# EAGLE design bldc_controller (EAGLE 6.5.0)
AUTHOR: Douglas Hutchings; REVISION: A; YEAR: 2014

## Sheet 1 of 5
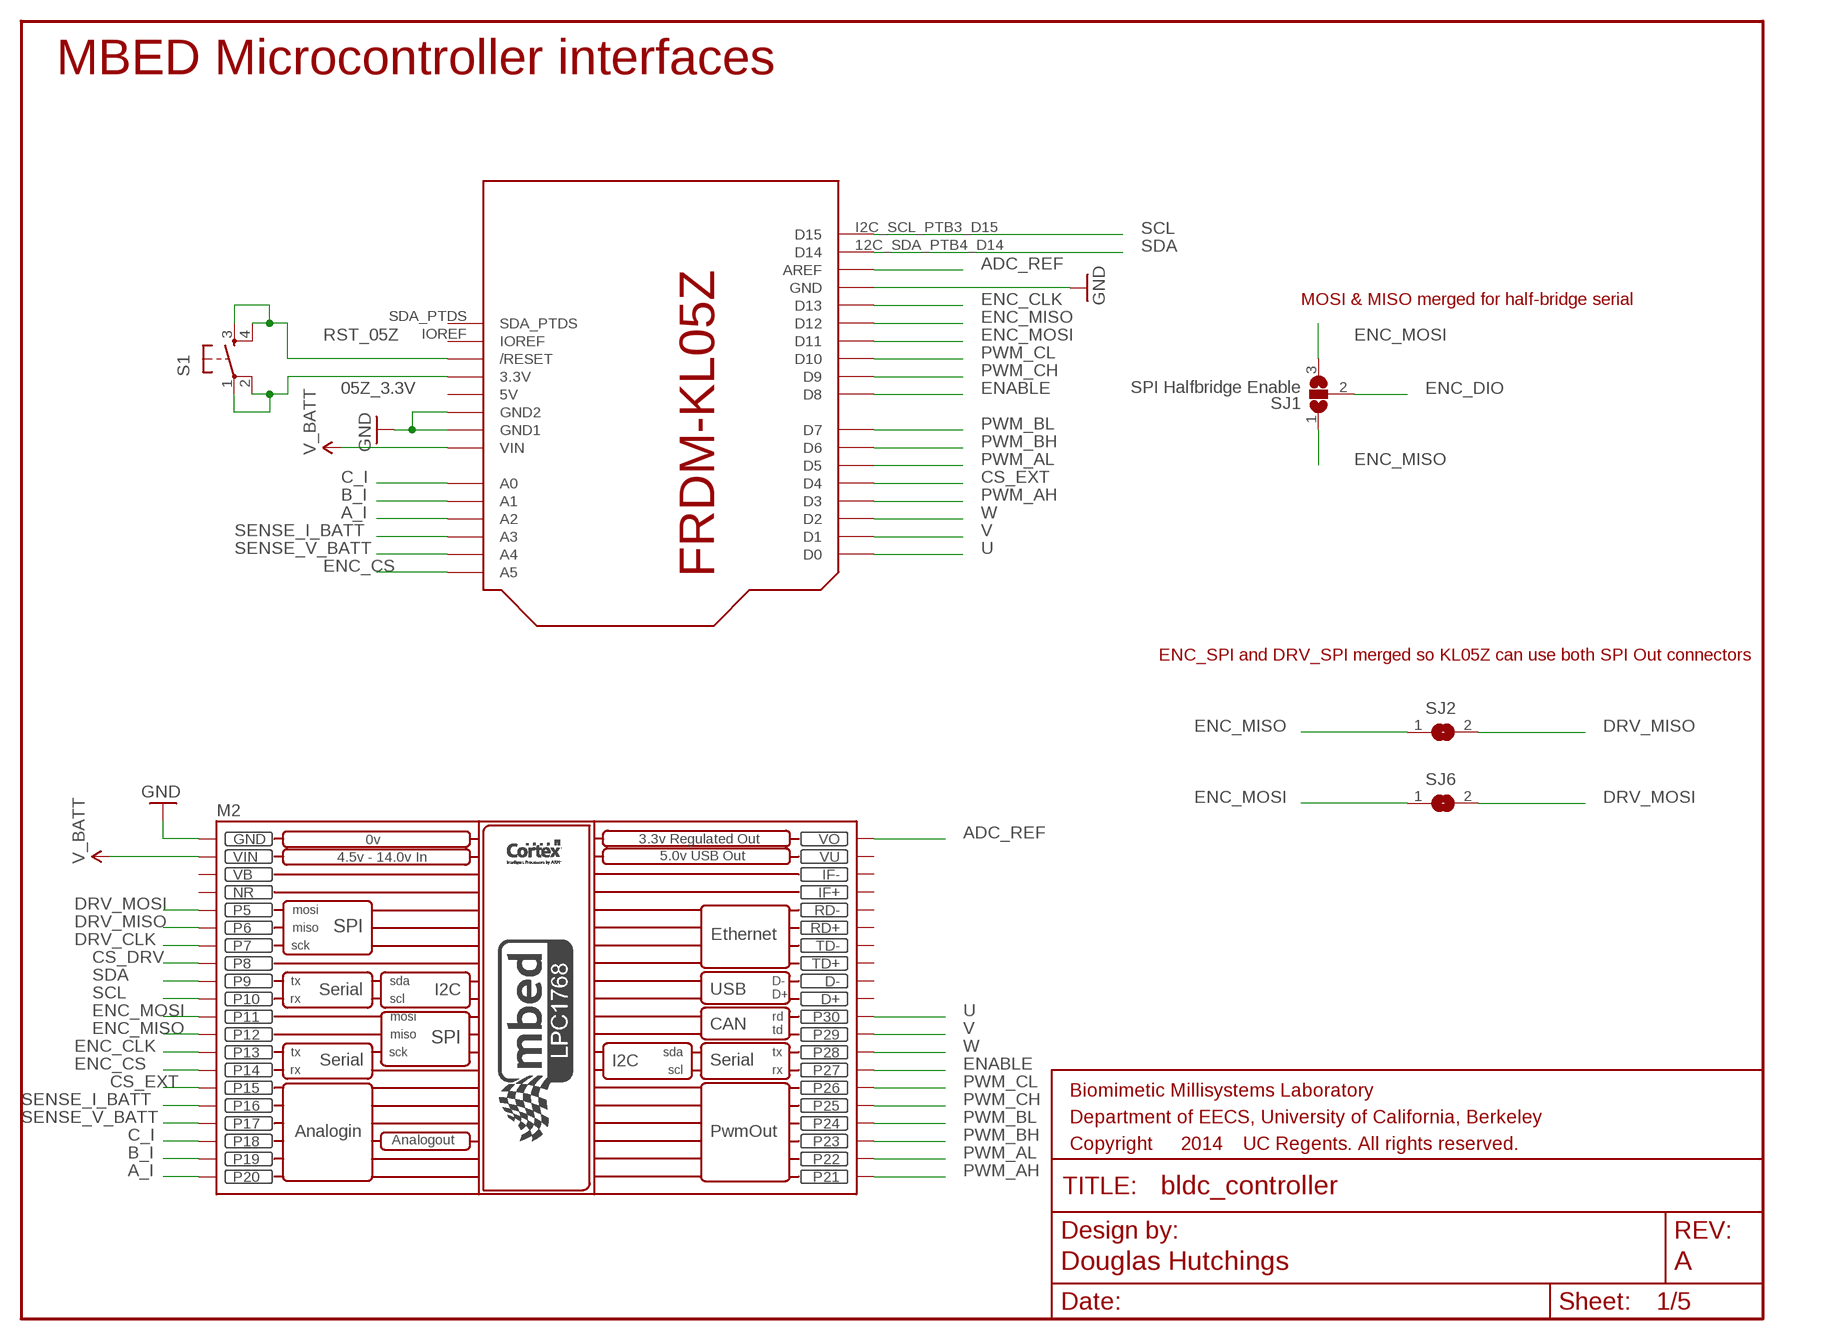
[diagram p0: schematic, sheet 1]

### Parts
M1  FRDM-KL05Z  [FREESCALEKL05Z]
M2  MBED_NXP_LPC1768  [MBED-KIT]
S1  TAC_SWITCHPTH  [TACTILE-PTH]
SJ1  SPI Halfbridge Enable  SJ2W  [SJ_2]
SJ2  SJ  [SJ]
SJ6  SJ  [SJ]

### Nets
05Z_3.3V: M1.3.3V S1.1 S1.2
A_I: M1.A2_PTA8(A2) M2.P$20(P20) ; also sheet 2
ADC_REF: M1.AVDD(AREF) M2.VOUT(VO) ; also sheet 2
B_I: M1.A1_PTB9(A1) M2.P$19(P19) ; also sheet 2
C_I: M1.A0_PTB8(A0) M2.P$18(P18) ; also sheet 2
CS_DRV: M2.P$8(P8) ; also sheet 2
CS_EXT: M1.PTA10_D4(D4) M2.P$15(P15) ; also sheet 4
DRV_CLK: M2.P$7(P7) ; also sheet 2
DRV_MISO: M2.P$6(P6) SJ2.2 ; also sheet 2,4
DRV_MOSI: M2.P$5(P5) SJ6.2 ; also sheet 2,4
ENABLE: M1.PTB10_D8(D8) M2.P$27(P27) ; also sheet 2
ENC_CLK: M1.SCK_PTB0_D13(D13) M2.P$13(P13) ; also sheet 5
ENC_CS: M1.A5_PTB13(A5) M2.P$14(P14) ; also sheet 4,5
ENC_DIO: SJ1.2 ; also sheet 5
ENC_MISO: M1.MISO_PTA6_D12(D12) M2.P$12(P12) SJ1.1 SJ2.1 ; also sheet 4
ENC_MOSI: M1.MOSI_PTA_D11(D11) M2.P$11(P11) SJ1.3 SJ6.1 ; also sheet 4
GND: M1.GND M1.GND1 M1.GND2 M2.GND ; also sheet 2,3,4,5
PWM_AH: M1.PTB5_D3(D3) M2.P$21(P21) ; also sheet 2
PWM_AL: M1.PTA12_D5(D5) M2.P$22(P22) ; also sheet 2
PWM_BH: M1.PTB6_D6(D6) M2.P$23(P23) ; also sheet 2
PWM_BL: M1.PTB7_D7(D7) M2.P$24(P24) ; also sheet 2
PWM_CH: M1.PTB11_D9(D9) M2.P$25(P25) ; also sheet 2
PWM_CL: M1.PTA_D10(D10) M2.P$26(P26) ; also sheet 2
RST_05Z: M1.RESET(/RESET) S1.3 S1.4
SCL: M1.I2C_SCL_PTB3_D15(D15) M2.P$10(P10) ; also sheet 4
SDA: M1.12C_SDA_PTB4_D14(D14) M2.P$9(P9) ; also sheet 4
SENSE_I_BATT: M1.A3_PTA0(A3) M2.P$16(P16) ; also sheet 3
SENSE_V_BATT: M1.A4_PTA9(A4) M2.P$17(P17) ; also sheet 3
U: M1.TX_PTB2_D0(D0) M2.P$30(P30) ; also sheet 4,5
V: M1.RX_PTB1_D1(D1) M2.P$29(P29) ; also sheet 4,5
V_BATT: M1.VIN M2.VIN ; also sheet 2,3,4,5
W: M1.PTA11_D2(D2) M2.P$28(P28) ; also sheet 4,5
Unconnected: M1.5V M1.IOREF M1.SDA_PTDS M2.D+ M2.D- M2.IF+ M2.IF- M2.RD+ M2.RD- M2.TD+ M2.TD- M2.VU

### Notes on the sheet
- MBED Microcontroller interfaces
- MOSI & MISO merged for half-bridge serial
- ENC_SPI and DRV_SPI merged so KL05Z can use both SPI Out connectors

## Sheet 2 of 5
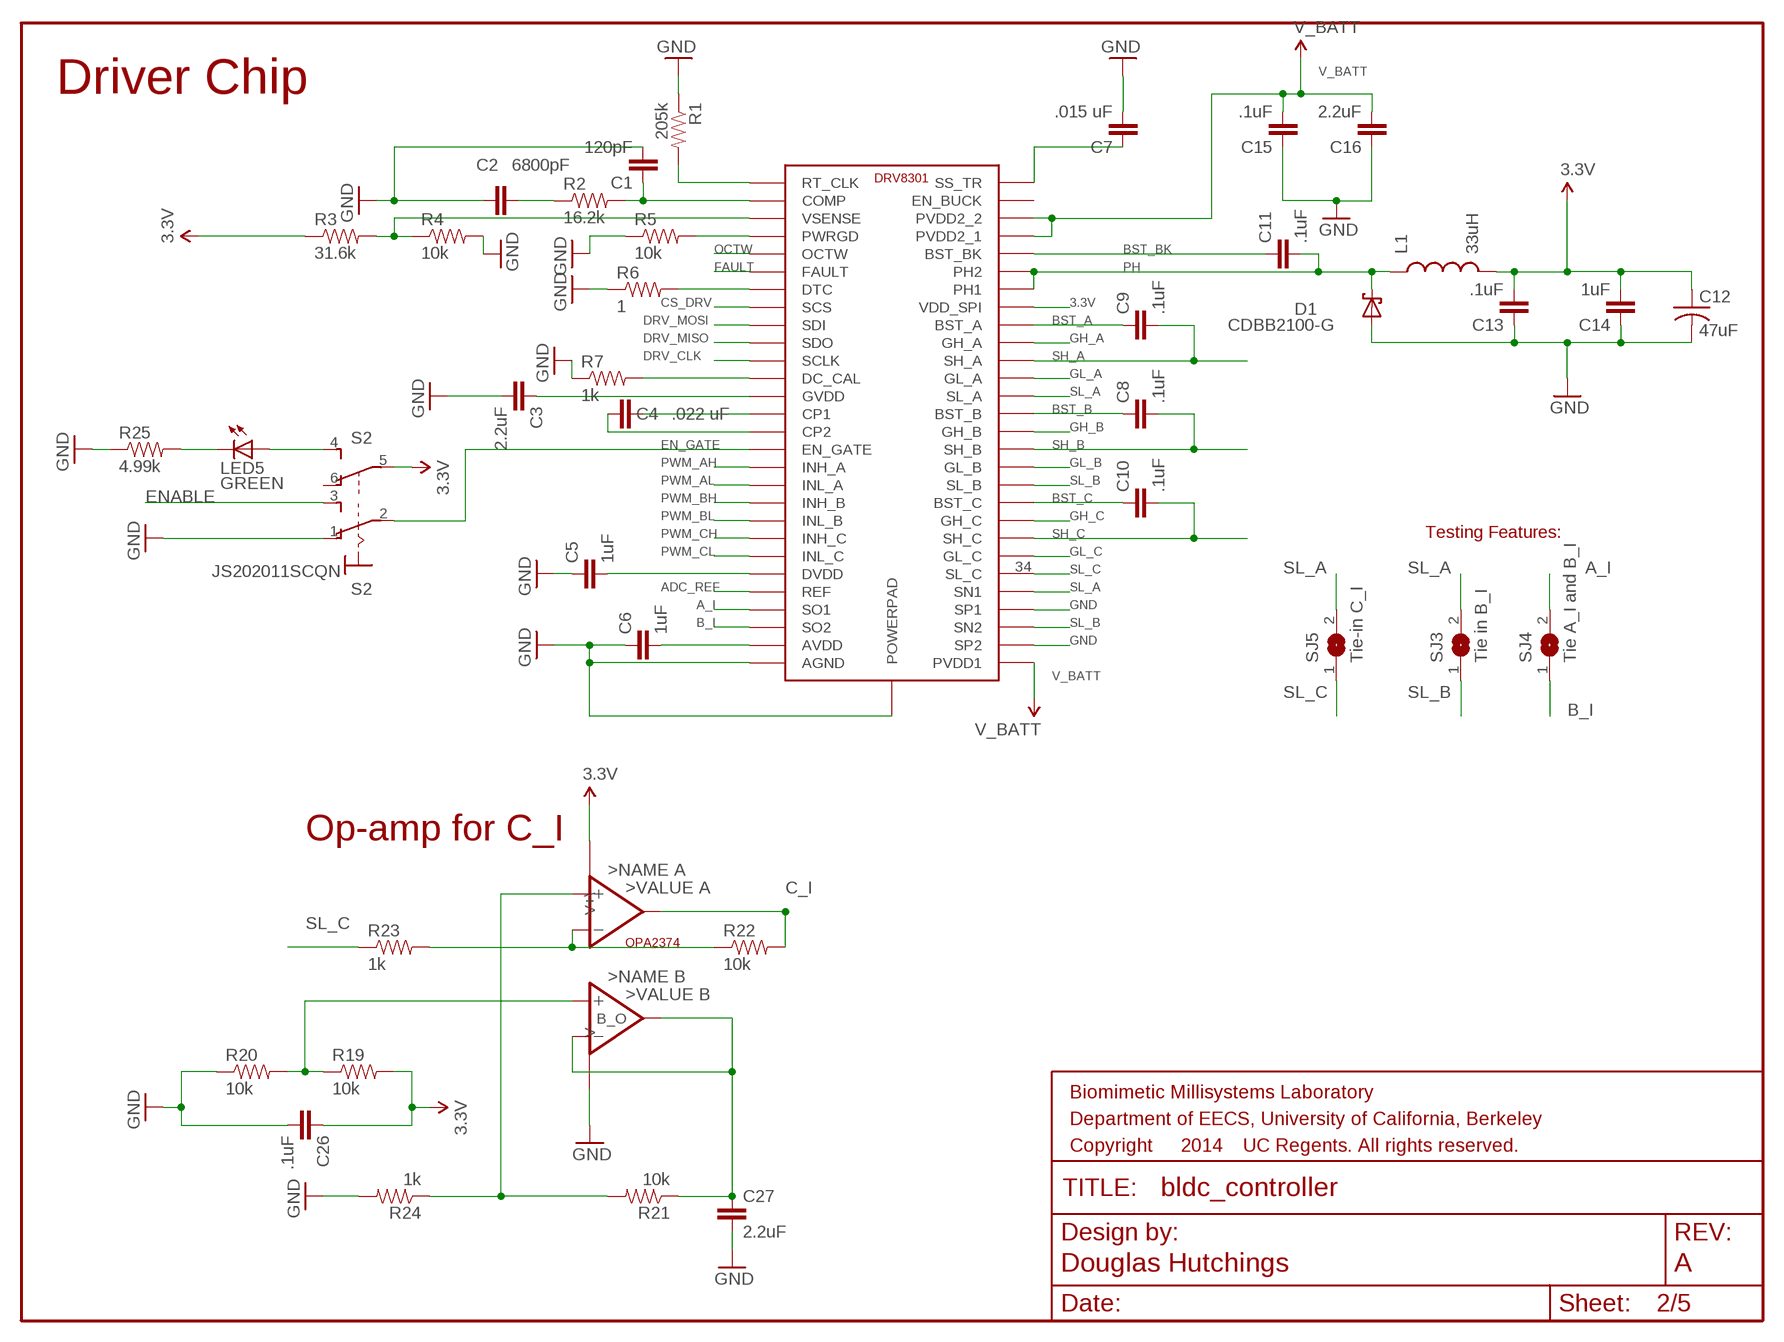
[diagram p1: schematic, sheet 2]

### Parts
C1  120pF  CAP0402-CAP  [0402-CAP]
C2  6800pF  CAP0402-CAP  [0402-CAP]
C3  2.2uF  CAP0402-CAP  [0402-CAP]
C4  .022 uF  CAP0402-CAP  [0402-CAP]
C5  1uF  CAP0402-CAP  [0402-CAP]
C6  1uF  CAP0402-CAP  [0402-CAP]
C7  .015 uF  CAP0402-CAP  [0402-CAP]
C8  .1uF  CAP0402-CAP  [0402-CAP]
C9  .1uF  CAP0402-CAP  [0402-CAP]
C10  .1uF  CAP0402-CAP  [0402-CAP]
C11  .1uF  CAP0402-CAP  [0402-CAP]
C12  47uF  C-USC0603  [C0603]
C13  .1uF  CAP0402-CAP  [0402-CAP]
C14  1uF  CAP0402-CAP  [0402-CAP]
C15  .1uF  CAP0402-CAP  [0402-CAP]
C16  2.2uF  CAP0402-CAP  [0402-CAP]
C26  .1uF  CAP0402-CAP  [0402-CAP]
C27  2.2uF  CAP0402-CAP  [0402-CAP]
D1  CDBB2100-G  SCHOTTKY-DIODESMD  [SMB]
IC1  DRV8301  [DRV8301]
IC2  OPA2374  [SOT-23]
L1  33uH  INDUCTOR0805  [0805]
LED5  GREEN  LED0603  [LED-0603]
R1  205k  RESISTOR0402-RES  [0402-RES]
R2  16.2k  RESISTOR0402-RES  [0402-RES]
R3  31.6k  RESISTOR0402-RES  [0402-RES]
R4  10k  RESISTOR0402-RES  [0402-RES]
R5  10k  RESISTOR0402-RES  [0402-RES]
R6  1  RESISTOR0402-RES  [0402-RES]
R7  1k  RESISTOR0402-RES  [0402-RES]
R19  10k  RESISTOR0402-RES  [0402-RES]
R20  10k  RESISTOR0402-RES  [0402-RES]
R21  10k  RESISTOR0402-RES  [0402-RES]
R22  10k  RESISTOR0402-RES  [0402-RES]
R23  1k  RESISTOR0402-RES  [0402-RES]
R24  1k  RESISTOR0402-RES  [0402-RES]
R25  4.99k  RESISTOR0603-RES  [0603-RES]
S2  JS202011SCQN  [JS202011SCQN]
SJ3  Tie in B_I  SJ  [SJ]
SJ4  Tie A_I and B_I  SJ  [SJ]
SJ5  Tie-in C_I  SJ  [SJ]

### Nets
3.3V: C12.1 C13.2 C14.2 C26.1 IC1.49(VDD_SPI) IC2.5(V+\) L1.2 R3.1 R19.2 S2.5(P) ; also sheet 4,5
3.3V1: LED5.A S2.4(S)
A_I: IC1.25(SO1) SJ4.2 ; also sheet 1
ADC_REF: IC1.24(REF) ; also sheet 1
AVDD: C6.2 IC1.27(AVDD)
B_I: IC1.26(SO2) SJ4.1 ; also sheet 1
BST_A: C9.1 IC1.48(BST_A)
BST_B: C8.1 IC1.43(BST_B)
BST_BK: C11.1 IC1.52(BST_BK)
BST_C: C10.1 IC1.38(BST_C)
C_I: IC2.1(A_O) R22.2 ; also sheet 1
CP1: C4.2 IC1.14(CP1)
CP2: C4.1 IC1.15(CP2)
CS_DRV: IC1.8(SCS) ; also sheet 1
DC_CAL: IC1.12(DC_CAL) R7.2
DRV_CLK: IC1.11(SCLK) ; also sheet 1
DRV_MISO: IC1.10(SDO) ; also sheet 1,4
DRV_MOSI: IC1.9(SDI) ; also sheet 1,4
DTC: IC1.7(DTC) R6.2
DVDD: C5.2 IC1.23(DVDD)
EN_GATE: IC1.16(EN_GATE) S2.2(P)
ENABLE: S2.3(S) ; also sheet 1
FAULT: IC1.6(FAULT) ; also sheet 4
GH_A: IC1.47(GH_A) ; also sheet 3
GH_B: IC1.42(GH_B) ; also sheet 3
GH_C: IC1.37(GH_C) ; also sheet 3
GL_A: IC1.45(GL_A) ; also sheet 3
GL_B: IC1.40(GL_B) ; also sheet 3
GL_C: IC1.35(GL_C) ; also sheet 3
GND: C1.2 C2.2 C3.2 C5.1 C6.1 C7.2 C12.2 C13.1 C14.1 C15.1 C16.1 C26.2 C27.2 D1.A IC1.28(AGND) IC1.30(SP2) IC1.32(SP1) IC1.EXP@1(POWERPAD) IC1.EXP@2(POWERPAD) IC2.4(V-) R1.1 R4.2 R5.1 R6.1 R7.1 R20.1 R24.2 R25.1 S2.1(O) ; also sheet 1,3,4,5
GVDD: C3.1 IC1.13(GVDD)
N$1: C1.1 IC1.2(COMP) R2.2
N$2: C2.1 R2.1
N$12: IC2.8(B+) R19.1 R20.2
N$14: C27.1 IC2.6(B_O) IC2.7(B-) R21.1
N$15: IC2.3(A+) R21.2 R24.1
N$16: IC2.2(A-) R22.1 R23.2
N$19: LED5.C R25.2
OCTW: IC1.5(OCTW) ; also sheet 4
PH: C11.2 D1.C IC1.50(PH1) IC1.51(PH2) L1.1
PWM_AH: IC1.17(INH_A) ; also sheet 1
PWM_AL: IC1.18(INL_A) ; also sheet 1
PWM_BH: IC1.19(INH_B) ; also sheet 1
PWM_BL: IC1.20(INL_B) ; also sheet 1
PWM_CH: IC1.21(INH_C) ; also sheet 1
PWM_CL: IC1.22(INL_C) ; also sheet 1
PWRGD: IC1.4(PWRGD) R5.2
RT_CLK: IC1.1(RT_CLK) R1.2
SH_A: C9.2 IC1.46(SH_A) ; also sheet 3
SH_B: C8.2 IC1.41(SH_B) ; also sheet 3
SH_C: C10.2 IC1.36(SH_C) ; also sheet 3
SL_A: IC1.33(SN1) IC1.44(SL_A) SJ3.2 SJ5.2 ; also sheet 3
SL_B: IC1.31(SN2) IC1.39(SL_B) SJ3.1 ; also sheet 3
SL_C: IC1.34(SL_C) R23.1 SJ5.1 ; also sheet 3
SS_TR: C7.1 IC1.56(SS_TR)
V_BATT: C15.2 C16.2 IC1.29(PVDD1) IC1.53(PVDD2_1) IC1.54(PVDD2_2) ; also sheet 1,3,4,5
VSENSE: IC1.3(VSENSE) R3.2 R4.1
Unconnected: IC1.55(EN_BUCK) S2.6(O)

### Notes on the sheet
- Driver Chip
- Testing Features:
- Op-amp for C_I

## Sheet 3 of 5
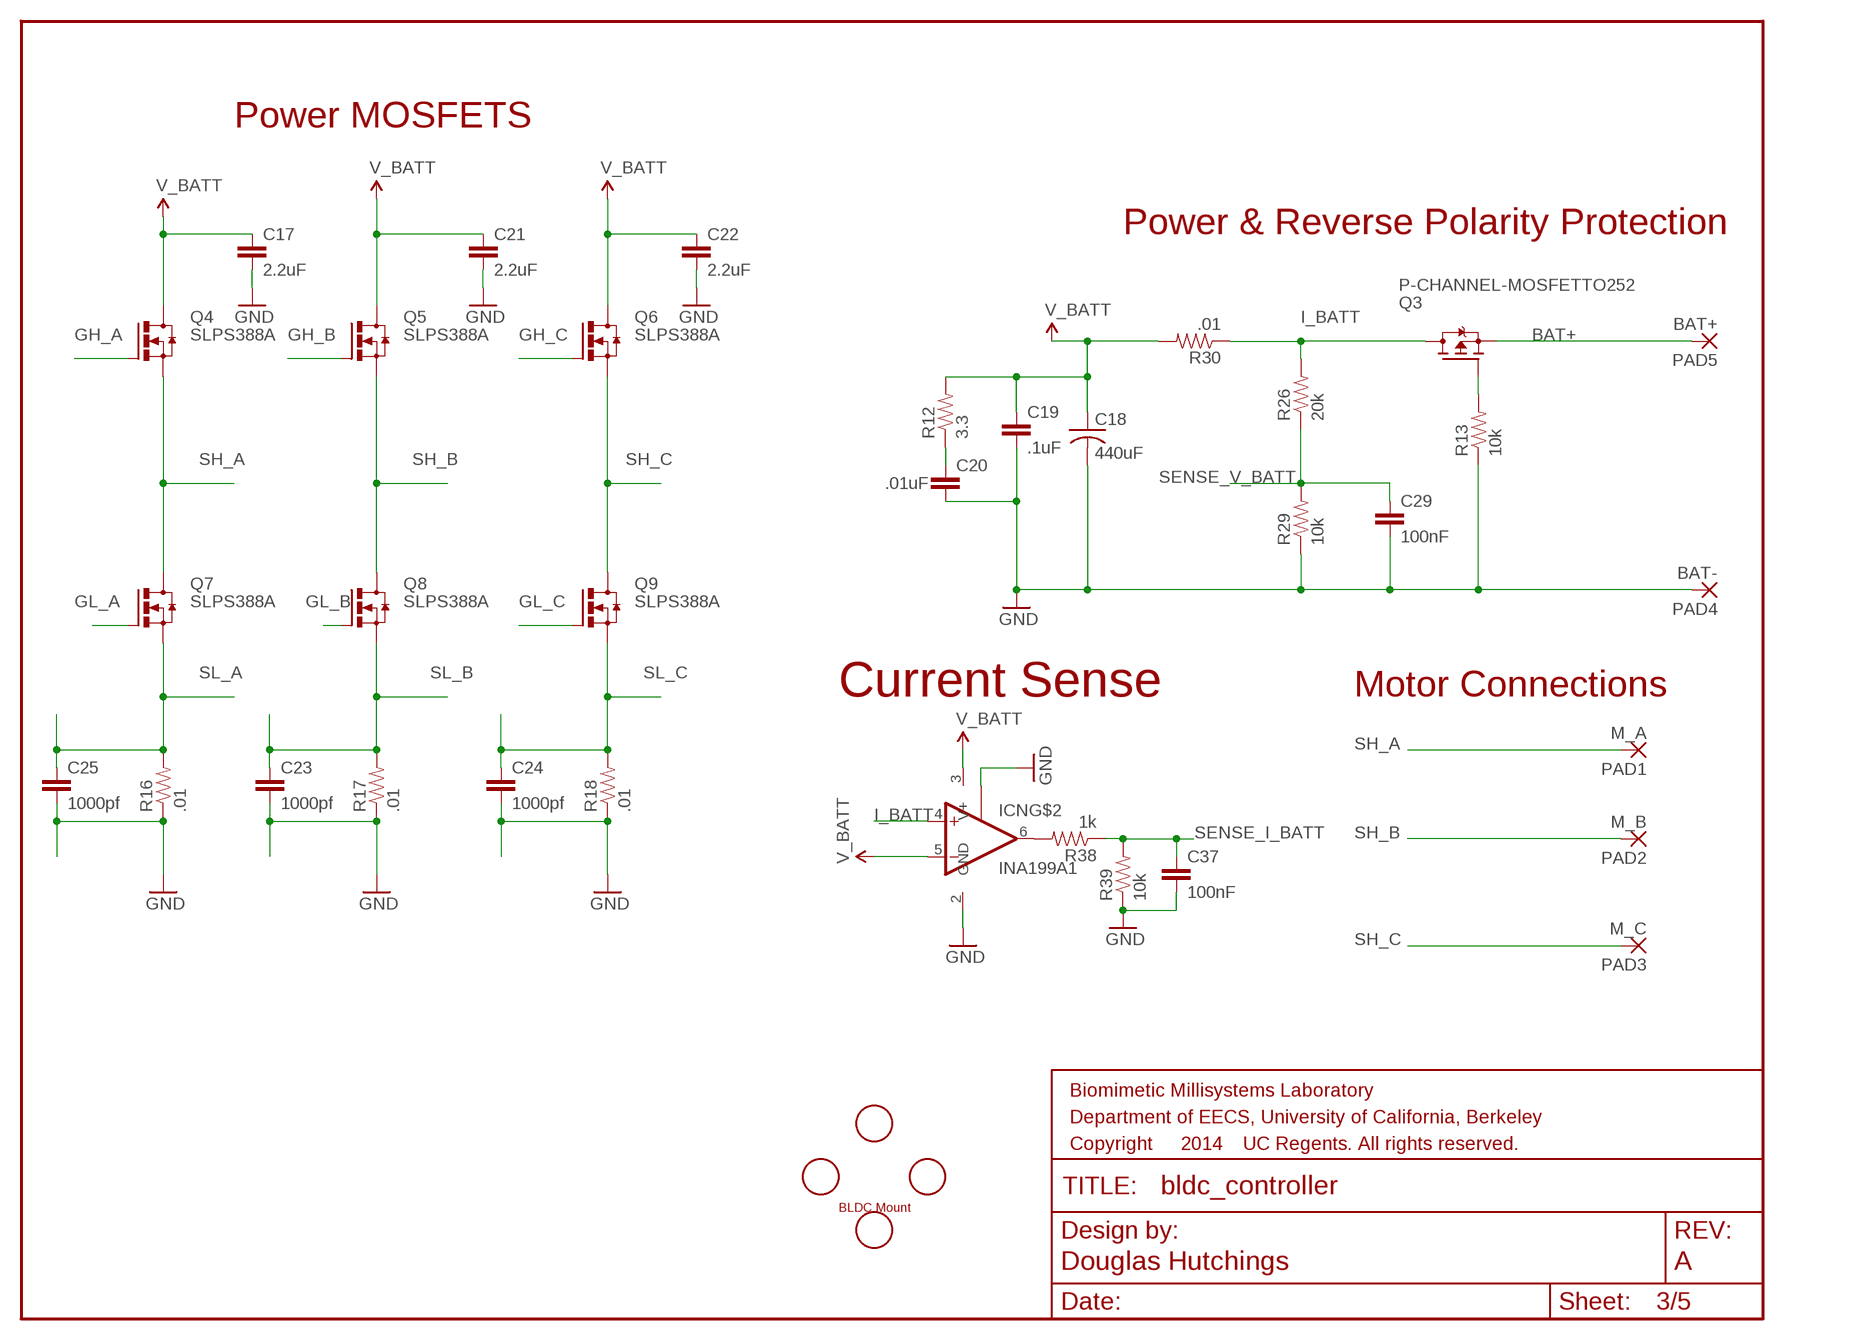
[diagram p2: schematic, sheet 3]

### Parts
C17  2.2uF  CAP0603-CAP  [0603-CAP]
C18  440uF  C-USC1210  [C1210]
C19  .1uF  CAP0402-CAP  [0402-CAP]
C20  .01uF  CAP0402-CAP  [0402-CAP]
C21  2.2uF  CAP0603-CAP  [0603-CAP]
C22  2.2uF  CAP0603-CAP  [0603-CAP]
C23  1000pf  CAP0603-CAP  [0603-CAP]
C24  1000pf  CAP0603-CAP  [0603-CAP]
C25  1000pf  CAP0603-CAP  [0603-CAP]
C29  100nF  CAP0402-CAP  [0402-CAP]
C37  100nF  CAP0402-CAP  [0402-CAP]
ICN  INA199A1  [SC70-6]
PAD1  M_A  SMD2  [SMD1,27-2,54]
PAD2  M_B  SMD2  [SMD1,27-2,54]
PAD3  M_C  SMD2  [SMD1,27-2,54]
PAD4  BAT-  SMD2  [SMD1,27-2,54]
PAD5  BAT+  SMD2  [SMD1,27-2,54]
Q3  P-CHANNEL-MOSFETTO252  [TO252]
Q4  SLPS388A  [SLPS388A]
Q5  SLPS388A  [SLPS388A]
Q6  SLPS388A  [SLPS388A]
Q7  SLPS388A  [SLPS388A]
Q8  SLPS388A  [SLPS388A]
Q9  SLPS388A  [SLPS388A]
R12  3.3  RESISTOR0402-RES  [0402-RES]
R13  10k  RESISTOR0603-RES  [0603-RES]
R16  .01  RESISTOR2010  [R2010]
R17  .01  RESISTOR2010  [R2010]
R18  .01  RESISTOR2010  [R2010]
R26  20k  RESISTOR0402-RES  [0402-RES]
R29  10k  RESISTOR0402-RES  [0402-RES]
R30  .01  RESISTOR2010  [R2010]
R38  1k  RESISTOR0402-RES  [0402-RES]
R39  10k  RESISTOR0402-RES  [0402-RES]
U$8  BLDC_MOUNT  [BLDC_MOUNT]

### Nets
BAT+: PAD5.1(P) Q3.2(S)
GH_A: Q4.4(G) ; also sheet 2
GH_B: Q5.4(G) ; also sheet 2
GH_C: Q6.4(G) ; also sheet 2
GL_A: Q7.4(G) ; also sheet 2
GL_B: Q8.4(G) ; also sheet 2
GL_C: Q9.4(G) ; also sheet 2
GND: C17.2 C18.2 C19.2 C20.2 C21.2 C22.2 C23.2 C24.2 C25.2 C29.2 C37.2 ICN.1(REF) ICN.2(GND) PAD4.1(P) R13.1 R16.1 R17.1 R18.1 R29.1 R39.1 ; also sheet 1,2,4,5
I_BATT: ICN.4(+IN) Q3.3(D) R26.2 R30.1
N$7: C20.1 R12.1
N$9: Q3.1(G) R13.2
N$18: ICN.6(OUT) R38.2
SENSE_I_BATT: C37.1 R38.1 R39.2 ; also sheet 1
SENSE_V_BATT: C29.1 R26.1 R29.2 ; also sheet 1
SH_A: PAD1.1(P) Q4.1(S) Q4.2(S) Q4.3(S) Q7.5(D) Q7.6(D) Q7.7(D) Q7.8(D) Q7.PAD(D) ; also sheet 2
SH_B: PAD2.1(P) Q5.1(S) Q5.2(S) Q5.3(S) Q8.5(D) Q8.6(D) Q8.7(D) Q8.8(D) Q8.PAD(D) ; also sheet 2
SH_C: PAD3.1(P) Q6.1(S) Q6.2(S) Q6.3(S) Q9.5(D) Q9.6(D) Q9.7(D) Q9.8(D) Q9.PAD(D) ; also sheet 2
SL_A: C25.1 Q7.1(S) Q7.2(S) Q7.3(S) R16.2 ; also sheet 2
SL_B: C23.1 Q8.1(S) Q8.2(S) Q8.3(S) R17.2 ; also sheet 2
SL_C: C24.1 Q9.1(S) Q9.2(S) Q9.3(S) R18.2 ; also sheet 2
V_BATT: C17.1 C18.1 C19.1 C21.1 C22.1 ICN.3(V+) ICN.5(-IN) Q4.5(D) Q4.6(D) Q4.7(D) Q4.8(D) Q4.PAD(D) Q5.5(D) Q5.6(D) Q5.7(D) Q5.8(D) Q5.PAD(D) Q6.5(D) Q6.6(D) Q6.7(D) Q6.8(D) Q6.PAD(D) R12.2 R30.2 ; also sheet 1,2,4,5

### Notes on the sheet
- Power MOSFETS
- Power & Reverse Polarity Protection
- Current Sense | Motor Connections

## Sheet 4 of 5
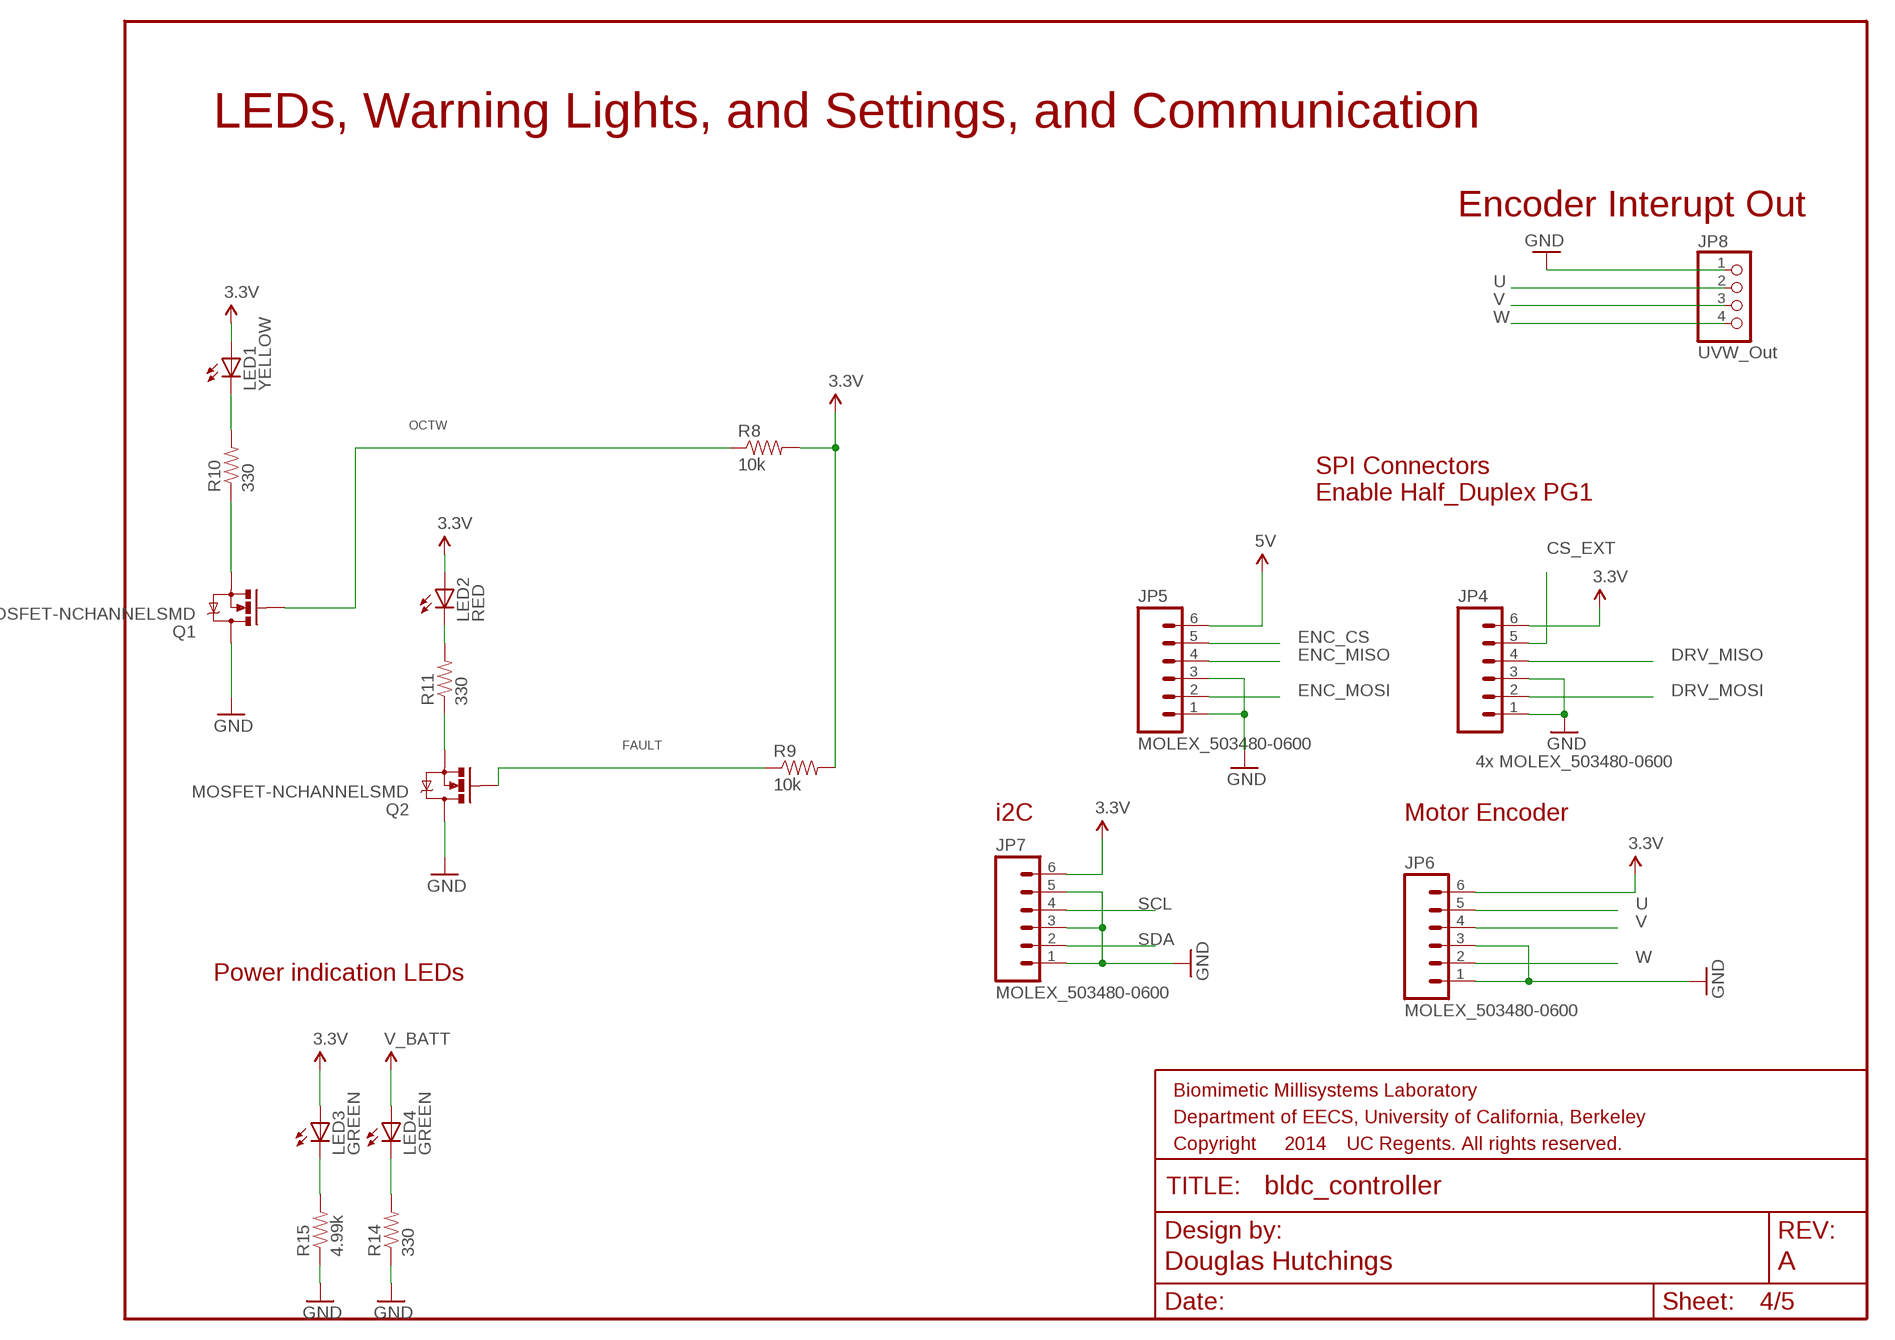
[diagram p3: schematic, sheet 4]

### Parts
JP4  4x MOLEX_503480-0600  MOLEX_503480-0600  [MOLEX_503480-0600]
JP5  MOLEX_503480-0600  [MOLEX_503480-0600]
JP6  MOLEX_503480-0600  [MOLEX_503480-0600]
JP7  MOLEX_503480-0600  [MOLEX_503480-0600]
JP8  UVW_Out  PINHD-1X4  [1X04]
LED1  YELLOW  LED0603  [LED-0603]
LED2  RED  LED0603  [LED-0603]
LED3  GREEN  LED0603  [LED-0603]
LED4  GREEN  LED0603  [LED-0603]
Q1  MOSFET-NCHANNELSMD  [SOT23-3]
Q2  MOSFET-NCHANNELSMD  [SOT23-3]
R8  10k  RESISTOR0402-RES  [0402-RES]
R9  10k  RESISTOR0402-RES  [0402-RES]
R10  330  RESISTOR0603-RES  [0603-RES]
R11  330  RESISTOR0603-RES  [0603-RES]
R14  330  RESISTOR0603-RES  [0603-RES]
R15  4.99k  RESISTOR0603-RES  [0603-RES]

### Nets
3.3V: JP4.6 JP6.6 JP7.6 LED1.A LED2.A LED3.A R8.2 R9.2 ; also sheet 2,5
5V: JP5.6 ; also sheet 5
CS_EXT: JP4.5 ; also sheet 1
DRV_MISO: JP4.4 ; also sheet 1,2
DRV_MOSI: JP4.2 ; also sheet 1,2
ENC_CS: JP5.5 ; also sheet 1,5
ENC_MISO: JP5.4 ; also sheet 1
ENC_MOSI: JP5.2 ; also sheet 1
FAULT: Q2.1(G) R9.1 ; also sheet 2
GND: JP4.1 JP4.3 JP5.1 JP5.3 JP6.1 JP6.3 JP7.1 JP7.3 JP7.5 JP8.1 Q1.3(D) Q2.3(D) R14.1 R15.1 ; also sheet 1,2,3,5
N$3: LED1.C R10.2
N$4: LED2.C R11.2
N$5: Q1.2(S) R10.1
N$6: Q2.2(S) R11.1
N$8: LED3.C R15.2
N$10: LED4.C R14.2
OCTW: Q1.1(G) R8.1 ; also sheet 2
SCL: JP7.4 ; also sheet 1
SDA: JP7.2 ; also sheet 1
U: JP6.5 JP8.2 ; also sheet 1,5
V: JP6.4 JP8.3 ; also sheet 1,5
V_BATT: LED4.A ; also sheet 1,2,3,5
W: JP6.2 JP8.4 ; also sheet 1,5

### Notes on the sheet
- LEDs, Warning Lights, and Settings, and Communication
- Encoder Interupt Out
- SPI Connectors
  Enable Half_Duplex PG1
- i2C | Motor Encoder
- Power indication LEDs

## Sheet 5 of 5
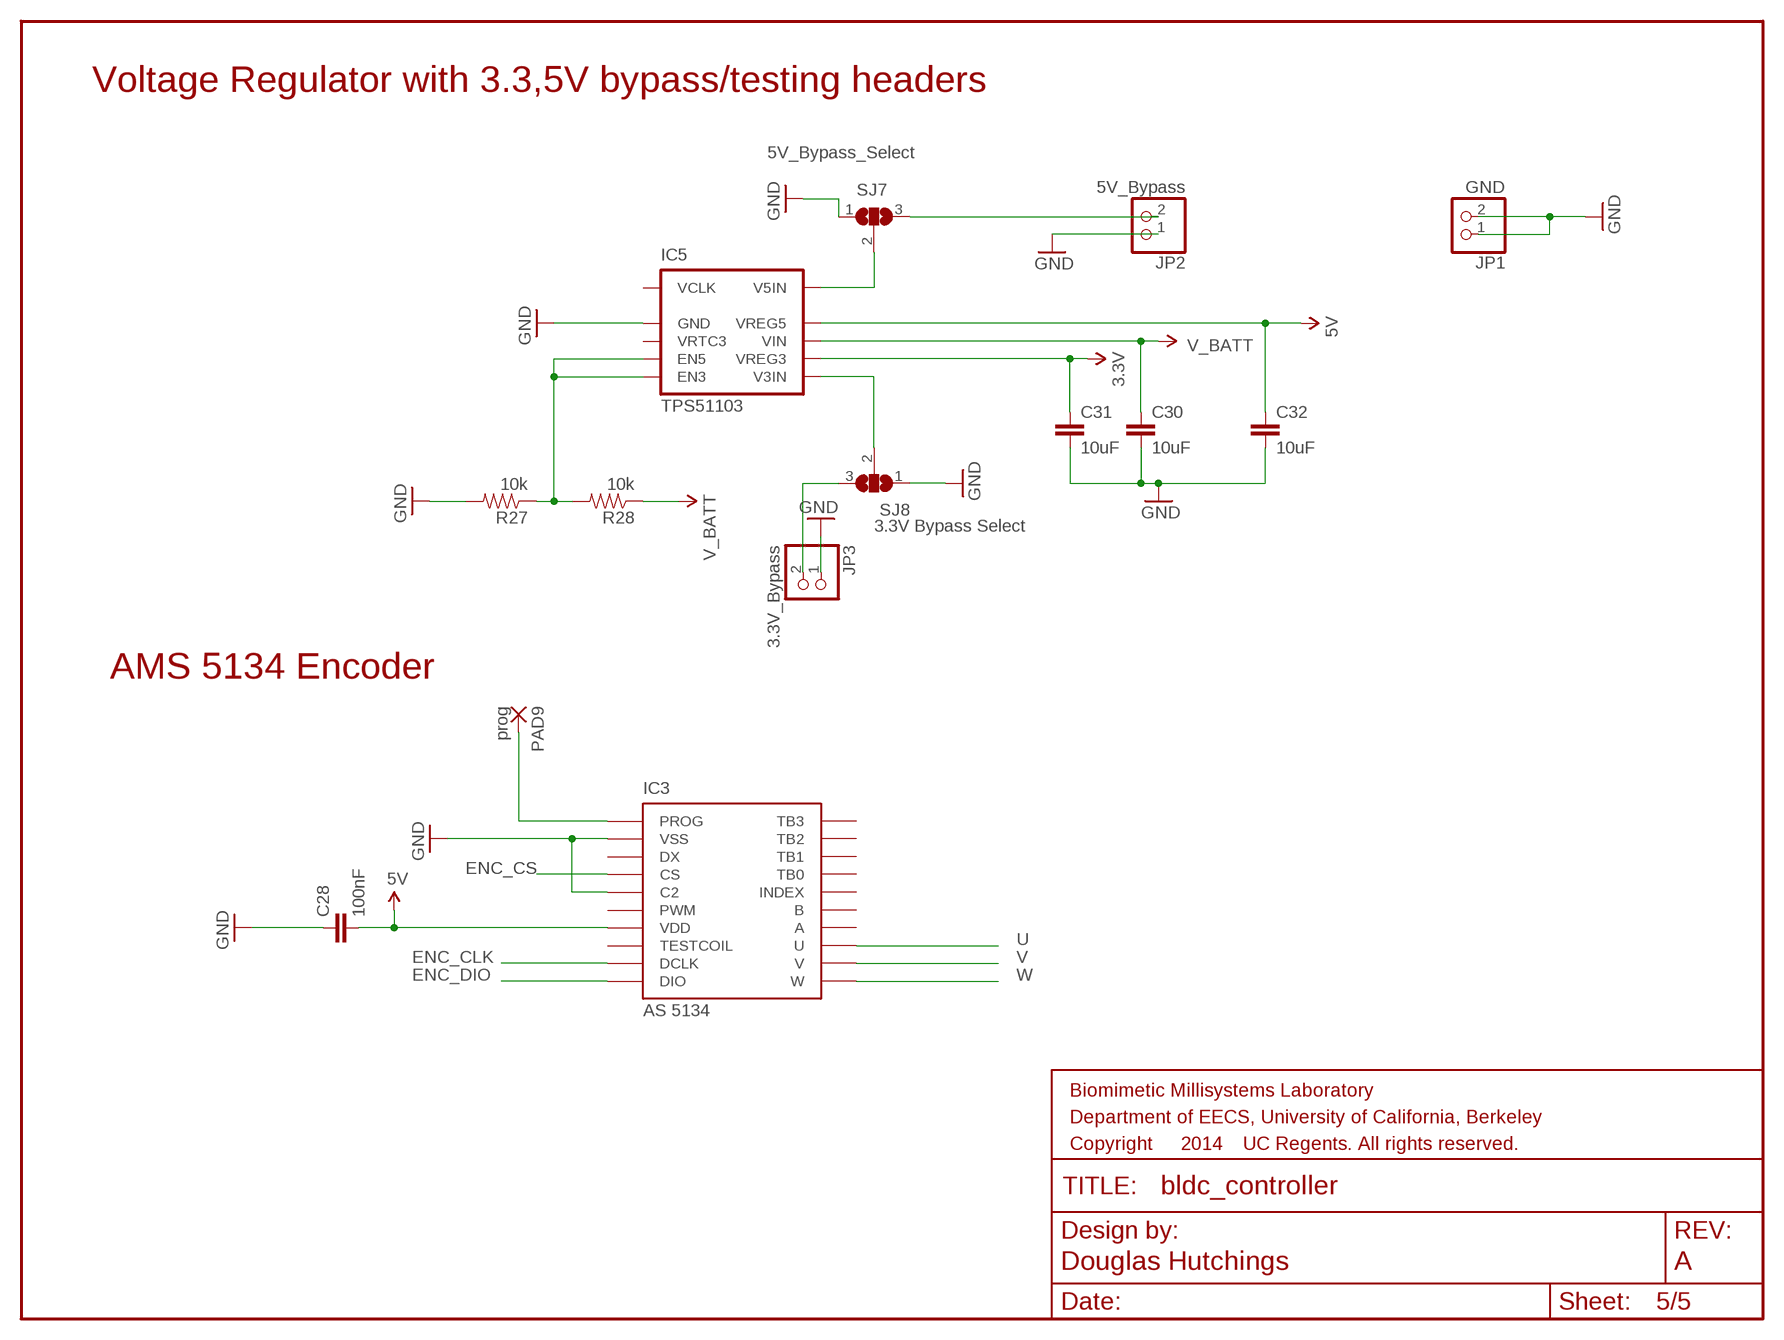
[diagram p4: schematic, sheet 5]

### Parts
C28  100nF  CAP0402-CAP  [0402-CAP]
C30  10uF  CAP0603-CAP  [0603-CAP]
C31  10uF  CAP0603-CAP  [0603-CAP]
C32  10uF  CAP0603-CAP  [0603-CAP]
IC3  AS 5134  AS5134  [AS5134]
IC5  TPS51103  [DRC(S-PVSON-N10)]
JP1  GND  PINHD-1X2  [1X02]
JP2  5V_Bypass  PINHD-1X2  [1X02]
JP3  3.3V_Bypass  PINHD-1X2  [1X02]
PAD9  prog  SMD2  [SMD1,27-2,54]
R27  10k  RESISTOR0402-RES  [0402-RES]
R28  10k  RESISTOR0402-RES  [0402-RES]
SJ7  5V_Bypass_Select  SJ2W  [SJ_2]
SJ8  3.3V Bypass Select  SJ2W  [SJ_2]

### Nets
3.3V: C31.1 IC5.7(VREG3) ; also sheet 2,4
5V: C28.2 C32.1 IC3.7(VDD) IC5.9(VREG5) ; also sheet 4
ENC_CLK: IC3.9(DCLK) ; also sheet 1
ENC_CS: IC3.4(CS) ; also sheet 1,4
ENC_DIO: IC3.10(DIO) ; also sheet 1
GND: C28.1 C30.2 C31.2 C32.2 IC3.2(VSS) IC3.5(C2) IC5.2(GND) IC5.TH(GND) JP1.1 JP1.2 JP2.1 JP3.1 R27.2 SJ7.1 SJ8.1 ; also sheet 1,2,3,4
N$11: JP2.2 SJ7.3
N$13: JP3.2 SJ8.3
N$17: IC3.1(PROG) PAD9.1(P)
PWR_ENABLE1: IC5.4(EN5) IC5.5(EN3) R27.1 R28.2
U: IC3.11(U) ; also sheet 1,4
V: IC3.12(V) ; also sheet 1,4
V3IN1: IC5.6(V3IN) SJ8.2
V5IN1: IC5.10(V5IN) SJ7.2
V_BATT: C30.1 IC5.8(VIN) R28.1 ; also sheet 1,2,3,4
W: IC3.13(W) ; also sheet 1,4
Unconnected: IC3.3(DX) IC3.6(PWM) IC3.8(TESTCOIL) IC3.14(A) IC3.15(B) IC3.16(INDEX) IC3.17(TB0) IC3.18(TB1) IC3.19(TB2) IC3.20(TB3) IC5.1(VCLK) IC5.3(VRTC3)

### Notes on the sheet
- Voltage Regulator with 3.3,5V bypass/testing headers
- AMS 5134 Encoder

## Power pins joined to a net without a drawn wire
NR: M2.NR
VB: M2.VB

## Library data of the parts
C1-C11 C13-C17 C19-C32 C37 = biomimetic:CAP: Capacitor Standard 0603 ceramic capacitor, and 0.1" leaded capacitor.
C12 C18 = adafruit:C-US: CAPACITOR, American symbol
D1 = diode:SCHOTTKY-DIODE: Schottky Diode
IC1 = biomimetic:DRV8301: DRV8301, a BLDC controller
IC2 = biomimetic:OPA2374: OPA2374, A SMT Dual op amp
IC3 = modular_robotics:AS5134: AS5134 A rotary magnetic encoder primarily used for serial comms and BLDC control
IC5 = biomimetic:TPS51103: TPS 51103 - 5,3.3V regulator
ICN = modular_robotics:INA199A1
JP1-JP3 = pinhead:PINHD-1X2: PIN HEADER
JP4-JP7 = biomimetic:MOLEX_503480-0600
JP8 = pinhead:PINHD-1X4: PIN HEADER
L1 = biomimetic:INDUCTOR: Inductors Basic Inductor/Choke - 0603 and 1206. Footprints are not proven and vary greatly between part numbers.
LED1-LED5 = biomimetic:LED: LEDs Standard schematic elements and footprints for 5mm, 3mm, 1206, and 0603 sized LEDs. 5mm - Spark Fun Electronics SKU : COM-00529 (and others)
M1 = biomimetic:FRDM-KL05Z: Freescale FRDM-KL05Z
M2 = zumy:MBED_NXP_LPC1768: Mbed LPC1768 - ARM CORTEX v2.1 * Schematic symbol is now placed in eagles's default raster. *The pads diameter are suitable for routing between mbed pins * mbed pads are 0.8 mm drill diameter. --------------------------------------------- Created by: Mohamed Yousry *Alexandria, Egypt *Email: mohamed.yousry@ieeegoldegypt.org
PAD1-PAD5 PAD9 = wirepad:SMD2: SMD PAD
Q1 Q2 = pie:MOSFET-NCHANNEL: N-Type MOSFET, SOT23-3 Package
Q3 = pie:P-CHANNEL-MOSFET: P-Channel PowerTrench® MOSFET Source: FDD4141.pdf; PIE-DIGIKEY-PN-PRI: IPD90P03P4L-04INCT-ND
Q4-Q9 = biomimetic:SLPS388A: SLPS388A power mosfet
R1-R30 R38 R39 = biomimetic:RESISTOR: Resistor Basic schematic elements and footprints for 0603, 1206, and PTH resistors.
S1 = pie:TAC_SWITCH: Momentary Switch Button commonly used for reset or general input. Spark Fun Electronics SKU : COM-00097; PIE-INT-REF-NUM: pth_pushbutton
S2 = modular_robotics:JS202011SCQN
SJ1 SJ7 SJ8 = jumper:SJ2W: SMD solder JUMPER
SJ2-SJ6 = jumper:SJ: SMD solder JUMPER
U$8 = modular_robotics:BLDC_MOUNT

## Board
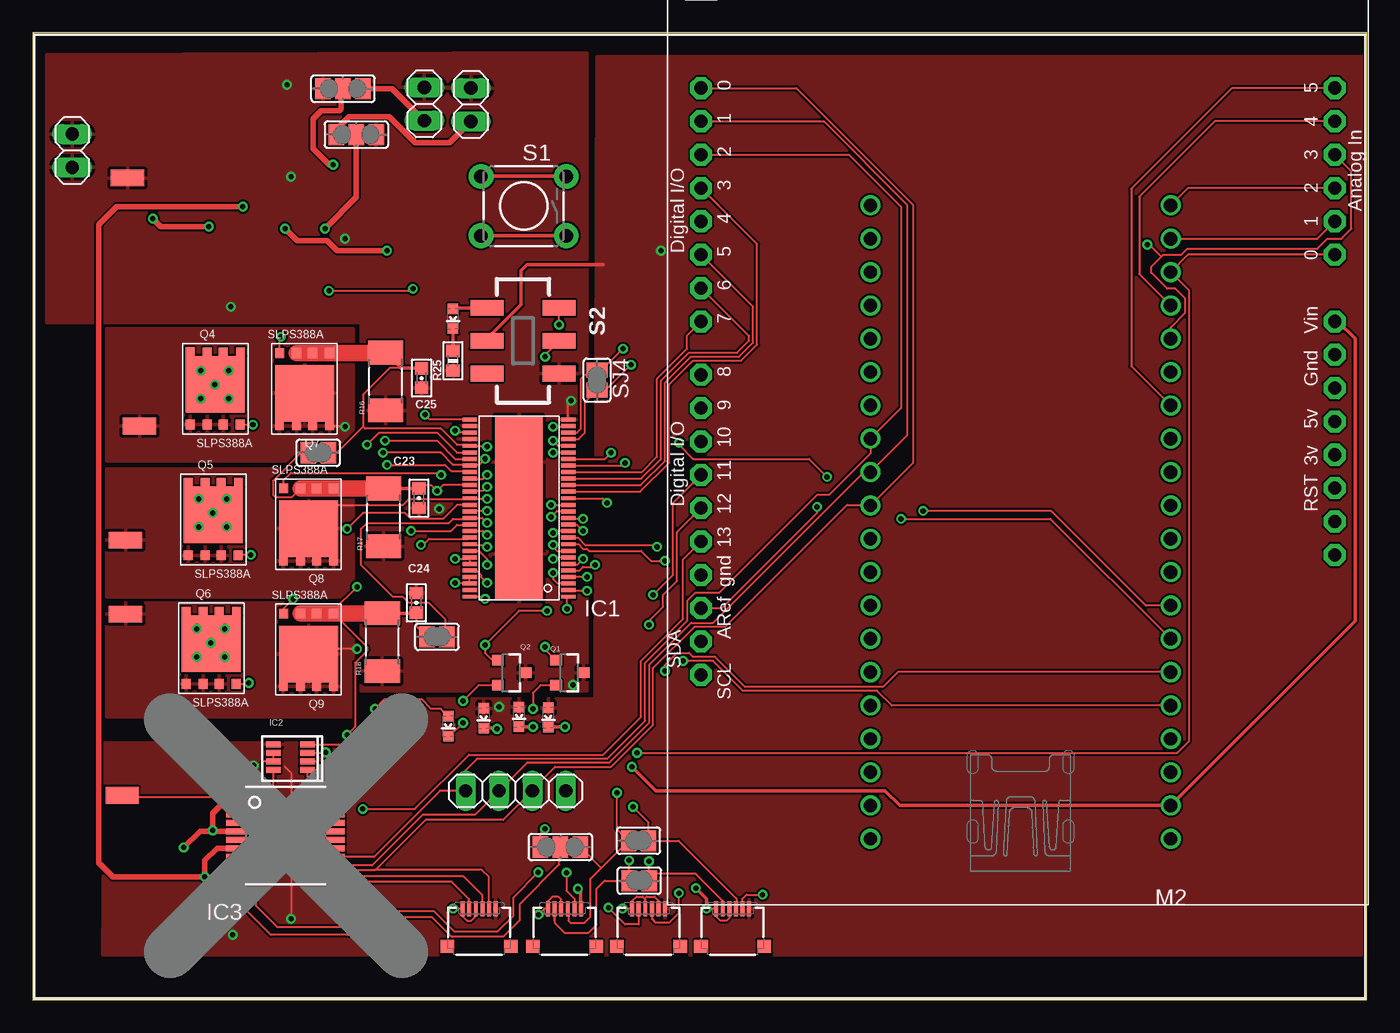
[diagram p5: board, top side]
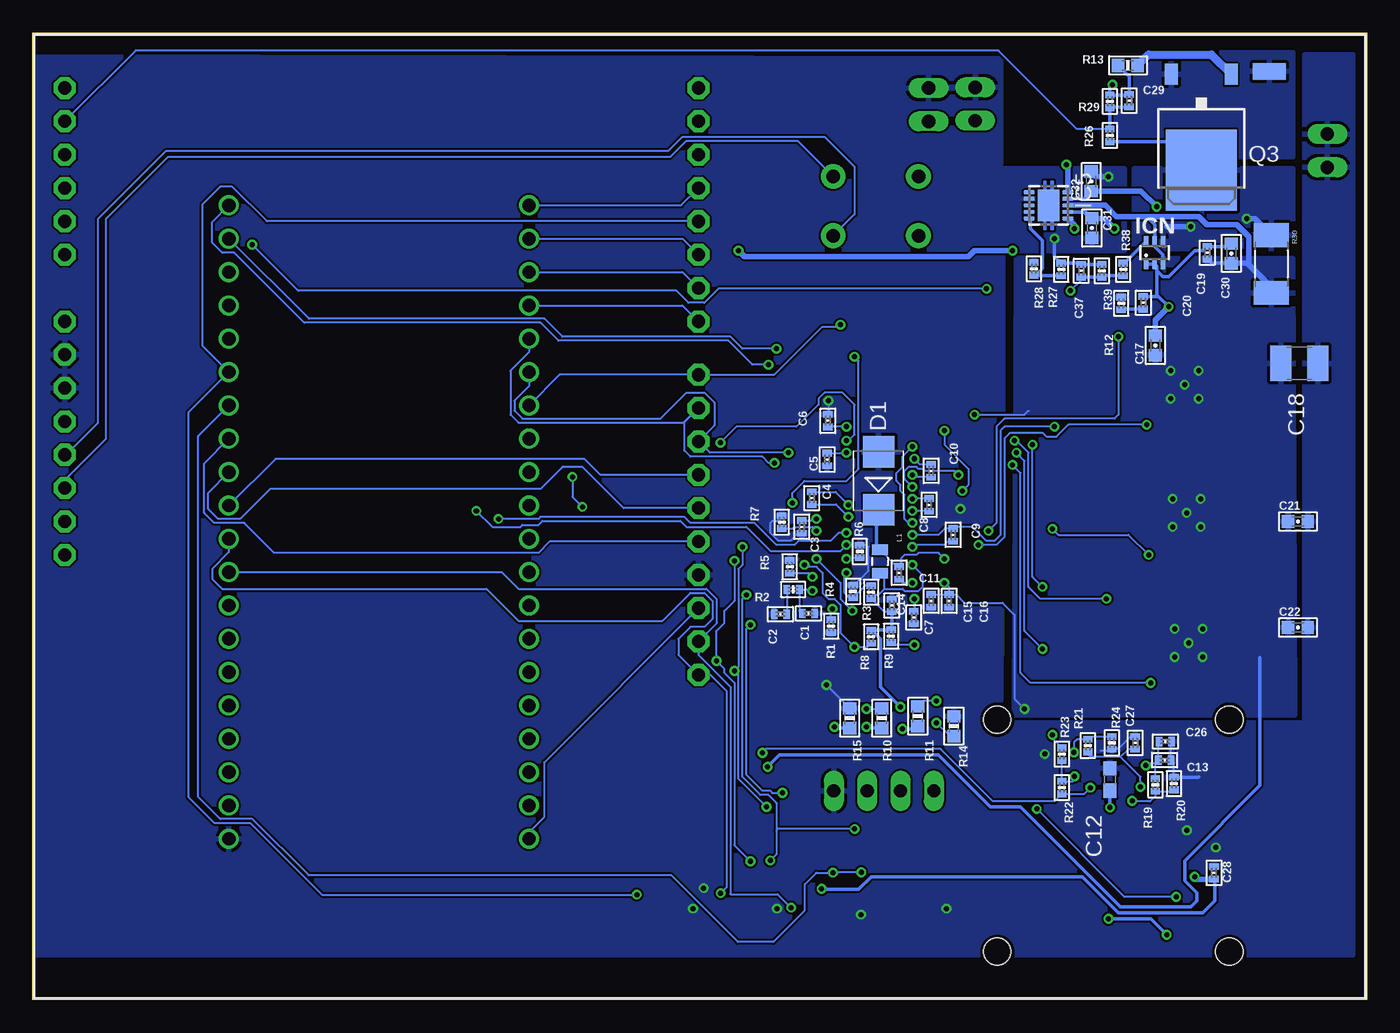
[diagram p6: board, bottom side, seen from below]

Size 101.6 x 73.66 mm. Coordinates in mm from the lower left corner, seen from the top.
Outline: 0,0 101.6,0 101.6,73.66 0,73.66 0,0
Copper layers (1*16): Top 2mil / dielectric 27mil / Bottom 2mil
Design rules "advancedcircuits-standard-biomimetic *": minimum track width 5mil, minimum drill 10mil, track to track 6mil, track to pad 6mil, pad to pad 6mil, via to via 6mil, smd to smd 6mil, copper to edge 0.256540625mm, drill to drill 0.256540625mm, minimum pad ring 0.180340625mm, minimum via ring 0.180340625mm, stop-mask expansion 2mil, vias tented up to drill 0mil, thermal gap 10mil

### Footprints (pad centres in the part's own frame; a part is rotated, then mirrored left to right if it is on the bottom)
0402-CAP = smd 0.508 x 0.711: 1 -0.483,0; 2 0.483,0
C0603 = smd 1.1 x 1: 1 -0.85,0; 2 0.85,0
0603-CAP = smd 0.94 x 1.016: 1 -0.749,0; 2 0.749,0
C1210 = smd 1.6 x 2.7: 1 -1.4,0; 2 1.4,0
SMB = smd 2.4 x 2.4: A 2.2,0; C -2.2,0
DRV8301 = smd 0.3 x 1.1: 1 -6.75,-3.75; 2 -6.25,-3.75; 3 -5.75,-3.75; 4 -5.25,-3.75; 5 -4.75,-3.75; 6 -4.25,-3.75; 7 -3.75,-3.75; 8 -3.25,-3.75; 9 -2.75,-3.75; 10 -2.25,-3.75; 11 -1.75,-3.75; 12 -1.25,-3.75; 13 -0.75,-3.75; 14 -0.25,-3.75; 15 0.25,-3.75; 16 0.75,-3.75; 17 1.25,-3.75; 18 1.75,-3.75; 19 2.25,-3.75; 20 2.75,-3.75; 21 3.25,-3.75; 22 3.75,-3.75; 23 4.25,-3.75; 24 4.75,-3.75; 25 5.25,-3.75; 26 5.75,-3.75; 27 6.25,-3.75; 28 6.75,-3.75; 29 6.75,3.75; 30 6.25,3.75; 31 5.75,3.75; 32 5.25,3.75; 33 4.75,3.75; 34 4.25,3.75; 35 3.75,3.75; 36 3.25,3.75; 37 2.75,3.75; 38 2.25,3.75; 39 1.75,3.75; 40 1.25,3.75; 41 0.75,3.75; 42 0.25,3.75; 43 -0.25,3.75; 44 -0.75,3.75; 45 -1.25,3.75; 46 -1.75,3.75; 47 -2.25,3.75; 48 -2.75,3.75; 49 -3.25,3.75; 50 -3.75,3.75; 51 -4.25,3.75; 52 -4.75,3.75; 53 -5.25,3.75; 54 -5.75,3.75; 55 -6.25,3.75; 56 -6.75,3.75 | smd 7 x 3.61: EXP@1 -3.5,0; EXP@2 3.5,0
SOT-23 = smd 0.45 x 1.1: 1 0,-1.3; 2 0.65,-1.3; 3 1.3,-1.3; 4 1.95,-1.3; 5 1.95,1.3; 6 1.3,1.3; 7 0.65,1.3; 8 0,1.3
AS5134 = smd 0.46 x 1.43: 1 -2.925,-3.795; 2 -2.275,-3.795; 3 -1.625,-3.795; 4 -0.975,-3.795; 5 -0.325,-3.795; 6 0.325,-3.795; 7 0.975,-3.795; 8 1.625,-3.795; 9 2.275,-3.795; 10 2.925,-3.795; 11 2.925,3.795; 12 2.275,3.795; 13 1.625,3.795; 14 0.975,3.795; 15 0.325,3.795; 16 -0.325,3.795; 17 -0.975,3.795; 18 -1.625,3.795; 19 -2.275,3.795; 20 -2.925,3.795
DRC(S-PVSON-N10) = smd 0.28 x 0.85: 1 -2.27,-1.475; 2 -1.77,-1.475; 3 -1.27,-1.475; 4 -0.77,-1.475; 5 -0.27,-1.475; 6 -0.27,1.475; 7 -0.77,1.475; 8 -1.27,1.475; 9 -1.77,1.475; 10 -2.27,1.475 | smd 2.4 x 1.65: TH -1.27,0
SC70-6 = smd 0.35 x 0.8: 1 -0.65,-0.85; 2 0,-0.85; 3 0.65,-0.85; 4 0.65,0.85; 5 0,0.85; 6 -0.65,0.85
1X02 = drill 1.016 long: 1 -1.27,0; 2 1.27,0
MOLEX_503480-0600 = smd 0.3 x 1.15: 1 -1.25,1.725; 2 -0.75,1.725; 3 -0.25,1.725; 4 0.25,1.725; 5 0.75,1.725; 6 1.25,1.725 | smd 1.035 x 1: L -2.408,-1.15; R 2.408,-1.15
1X04 = drill 1.016 long: 1 -3.81,0; 2 -1.27,0; 3 1.27,0; 4 3.81,0
0805 = smd 0.8 x 1.2: 1 -0.9,0; 2 0.9,0
LED-0603 = smd 0.8 x 0.8: A 0,-0.75; C 0,0.75
FREESCALEKL05Z = drill 1 pad 1.676 octagon: 3.3V 5.08,-24.13; 5V 7.62,-24.13; 12C_SDA_PTB4_D14 -9.144,24.13; A0_PTB8 20.32,-24.13; A1_PTB9 22.86,-24.13; A2_PTA8 25.4,-24.13; A3_PTA0 27.94,-24.13; A4_PTA9 30.48,-24.13; A5_PTB13 33.02,-24.13; AVDD -6.604,24.13; GND -4.064,24.13; GND1 12.7,-24.13; GND2 10.16,-24.13; I2C_SCL_PTB3_D15 -11.684,24.13; IOREF 0,-24.13; MISO_PTA6_D12 1.016,24.13; MOSI_PTA_D11 3.556,24.13; PTA10_D4 22.86,24.13; PTA11_D2 27.94,24.13; PTA12_D5 20.32,24.13; PTA_D10 6.096,24.13; PTB5_D3 25.4,24.13; PTB6_D6 17.78,24.13; PTB7_D7 15.24,24.13; PTB10_D8 11.176,24.13; PTB11_D9 8.636,24.13; RESET 2.54,-24.13; RX_PTB1_D1 30.48,24.13; SCK_PTB0_D13 -1.524,24.13; SDA_PTDS -2.54,-24.13; TX_PTB2_D0 33.02,24.13; VIN 15.24,-24.13
MBED-KIT = drill 1.016: D+ 11.43,1.27; D- 11.43,3.81; GND -11.43,24.13; IF+ 11.43,16.51; IF- 11.43,19.05; NR -11.43,16.51; P$5 -11.43,13.97; P$6 -11.43,11.43; P$7 -11.43,8.89; P$8 -11.43,6.35; P$9 -11.43,3.81; P$10 -11.43,1.27; P$11 -11.43,-1.27; P$12 -11.43,-3.81; P$13 -11.43,-6.35; P$14 -11.43,-8.89; P$15 -11.43,-11.43; P$16 -11.43,-13.97; P$17 -11.43,-16.51; P$18 -11.43,-19.05; P$19 -11.43,-21.59; P$20 -11.43,-24.13; P$21 11.43,-24.13; P$22 11.43,-21.59; P$23 11.43,-19.05; P$24 11.43,-16.51; P$25 11.43,-13.97; P$26 11.43,-11.43; P$27 11.43,-8.89; P$28 11.43,-6.35; P$29 11.43,-3.81; P$30 11.43,-1.27; RD+ 11.43,11.43; RD- 11.43,13.97; TD+ 11.43,6.35; TD- 11.43,8.89; VB -11.43,19.05; VIN -11.43,21.59; VOUT 11.43,24.13; VU 11.43,21.59
SMD1,27-2,54 = smd 1.27 x 2.54: 1 0,0
SOT23-3 = smd 0.8 x 0.9: 1 -0.95,-1; 2 0.95,-1; 3 0,1.1
TO252 = smd 1 x 1.6: 1 -2.28,-4.8; 2 2.28,-4.8 | smd 5.4 x 6.2: 3 0,2.5
SLPS388A = smd 0.75 x 0.675: 1 5.88,-4.173; 2 5.88,-2.877; 3 5.88,-1.657; 4 5.88,-0.348 | smd 0.665 x 0.675: 5 0.328,-0.338; 6 0.328,-1.657; 7 0.328,-2.877; 8 0.326,-4.173 | smd 4.295 x 4.51: PAD 2.805,-2.255
0402-RES = smd 0.508 x 0.711: 1 -0.483,0; 2 0.483,0
0603-RES = smd 0.94 x 1.016: 1 -0.749,0; 2 0.749,0
R2010 = smd 1.8 x 2.7: 1 -2.2,0; 2 2.2,0
TACTILE-PTH = drill 1.016 pad 1.88: 1 -3.251,2.261; 2 3.251,2.261; 3 -3.251,-2.261; 4 3.251,-2.261
JS202011SCQN = smd 1.2 x 2.5: 1 -2.5,-2.75; 2 0,-2.75; 3 2.5,-2.75; 4 2.5,2.75; 5 0,2.75; 6 -2.5,2.75
SJ_2 = smd 1.168 x 1.6: 1 -1.524,0; 2 0,0; 3 1.524,0
SJ = smd 1.168 x 1.6: 1 -0.762,0; 2 0.762,0
BLDC_MOUNT = hole 2.08: -12.5,0; 0,12.5; 12.5,0; 0,-12.5

### Placement (x,y rotation side)
C1  42.52,29.42 0 bottom
C2  44.65,29.37 180 bottom
C3  43.03,36.03 270 bottom
C4  42.27,38.21 270 bottom
C5  41.1,41.16 90 bottom
C6  41.05,44.11 270 bottom
C7  34.49,29.12 270 bottom
C8  33.32,37.71 90 bottom
C9  31.5,35.42 90 bottom
C10  33.17,40.3 90 bottom
C11  35.61,32.52 90 bottom
C12  19.56,16.78 90 bottom
C13  15.39,18.25 180 bottom
C14  36.17,30.03 270 bottom
C15  33.17,30.39 90 bottom
C16  31.8,30.39 90 bottom
C17  16.1,49.85 90 bottom
C18  5.13,48.47 0 bottom
C19  12.14,56.91 90 bottom
C20  17.02,53.1 90 bottom
C21  5.23,36.44 0 bottom
C22  5.23,28.36 0 bottom
C23  29.41,38.21 270 top
C24  29.21,30.24 90 top
C25  29.62,47.36 270 top
C26  15.34,19.67 0 bottom
C27  17.63,19.57 90 bottom
C28  11.63,9.66 270 bottom
C29  18.08,68.49 90 bottom
C30  10.31,56.86 90 bottom
C31  20.93,58.79 270 bottom
C32  20.98,62.34 90 bottom
C37  21.74,55.54 90 bottom
D1  37.19,39.53 90 bottom
IC1  37.03,37.45 90 top
IC2  19.61,17.51 90 top
IC3  19.25,12.51 270 top
IC5  24.23,59.24 270 bottom
ICN  16.15,56.91 0 bottom
JP1  3,64.68 270 top
JP2  29.82,68.24 270 top
JP3  33.38,68.19 270 top
JP4  53.3,5.21 0 top
JP5  40.5,5.21 0 top
JP6  33.99,5.21 0 top
JP7  46.9,5.21 0 top
JP8  36.78,15.91 180 top
L1  37.08,33.39 270 bottom
LED1  37.03,21.55 180 top
LED2  34.34,21.45 180 top
LED3  39.27,21.5 180 top
LED4  31.65,20.84 180 top
LED5  32,51.88 180 top
M1  75.03,36.44 90 top
M2  75.23,36.38 180 top
PAD1  8.13,43.7 90 top
PAD2  7.06,35.01 90 top
PAD3  7.06,29.37 90 top
PAD4  7.21,62.6 90 top
PAD5  7.42,70.73 270 bottom
PAD9  6.81,15.57 270 top
Q1  40.84,24.9 270 top
Q2  36.42,24.9 270 top
Q3  12.6,65.7 180 bottom
Q4  16.15,49.69 270 top
Q5  16,39.74 270 top
Q6  15.85,29.93 270 top
Q7  18.44,43.39 90 top
Q8  18.75,33.08 90 top
Q9  18.75,23.53 90 top
R1  40.79,28.46 90 bottom
R2  43.69,31.25 0 bottom
R3  37.74,31.05 90 bottom
R4  39.12,31.1 90 bottom
R5  43.94,32.98 270 bottom
R6  38.61,34.15 270 bottom
R7  44.55,36.38 270 bottom
R8  37.74,27.65 90 bottom
R9  36.22,27.7 90 bottom
R10  36.93,21.45 270 bottom
R11  34.19,21.6 270 bottom
R12  18.69,53.05 90 bottom
R13  18.19,71.18 0 bottom
R14  31.45,20.84 270 bottom
R15  39.37,21.45 270 bottom
R16  26.87,47.1 90 top
R17  26.72,36.74 90 top
R18  26.62,27.24 90 top
R19  16.1,16.37 90 bottom
R20  14.68,16.47 270 bottom
R21  21.24,19.37 90 bottom
R22  23.22,16.17 270 bottom
R23  23.22,18.71 270 bottom
R24  19.41,19.57 270 bottom
R25  32,48.68 90 top
R26  19.56,65.85 270 bottom
R27  23.27,55.64 90 bottom
R28  25.35,55.69 270 bottom
R29  19.56,68.44 270 bottom
R30  7.26,56.04 270 bottom
R38  18.54,55.64 90 bottom
R39  20.17,55.54 270 bottom
S1  37.39,60.46 180 top
S2  37.34,50.2 90 top
SJ1  40.19,11.63 180 top
SJ2  46.14,12.12 0 top
SJ3  21.74,41.67 0 top
SJ4  42.98,47.2 270 top
SJ5  30.78,27.65 0 top
SJ6  46.19,9.07 0 top
SJ7  23.62,69.4 0 top
SJ8  24.64,65.9 180 top
U$8  19.3,12.5 45 top

### Tracks (layer width: path | path; a pad name or v marks a point on that pad's centre or on a via)
3.3V  (via drill 0.38)
  Top 0.152: IC1.49 33.98,34.2 34.59,33.59 v34.59,33.13 | 19.2,17.74 19.66,17.28 v19.66,6.16 | S2.5 34.59,50.35
  Top 0.254: v35.51,22.31 35.51,22.16 | 34.59,50.35 37.19,52.95 37.19,55.54 37.64,55.99 43.43,55.99
  Top 0.406: v19.2,58.74 20.12,57.82 22.4,57.82 23.16,57.06 v26.98,57.06
  Bottom 0.152: R19.2 16.1,18.02 | 16.1,18.02 C13.2 15.88,19.62 C26.1 | 16.1,18.02 16.64,18.02 v16.82,17.84 | 19.66,15.82 C12.1 | 36.73,31.3 37.19,30.85 37.47,30.85 R3.1 36.73,29.55 C14.2 | 36.73,31.3 35.36,31.3 35.2,31.15 34.14,31.15 33.83,31.46 33.83,32.37 v34.59,33.13 | 36.73,31.3 36.73,32.13 L1.2
  Bottom 0.254: C31.1 21.41,60.01 IC5.7 21.55,60.01 21.03,59.5 | C14.2 36.17,28.23 R9.2 37.69,28.18 R8.2 37.67,28.13 37.03,27.49 37.03,23.84 v35.51,22.31 | C12.1 v19.56,14.65 v19.55,14.64 | v19.66,6.16 16.46,6.16 v15.24,4.94
  Bottom 0.406: 21.03,59.5 19.96,59.5 v19.2,58.74 | v26.98,57.06 29.87,57.06 30.33,56.6 47.4,56.6 v47.85,57.06
  pour Top: 42.98,71.84 103.17,71.84 103.17,3.42 5.33,3.42 5.49,19.57 27.74,19.57 27.74,22.92 42.82,22.92
3.3V1
  Top 0.254: S2.4 32.08,52.7 LED5.A
5V  (via drill 0.38)
  Top 0.254: JP5.6 41.72,6.97 41.72,8.26 arc90 v41.52,8.46
  Top 0.406: v16,60.41 6.4,60.41 5.03,59.04 5.03,10.43 6.1,9.36 v13.11,9.36 13.11,10.61 14.03,11.53 IC3.7
  Bottom 0.254: IC5.9 21.56,61.01 C32.1 | C28.2 11.58,9.13 11.58,7.53 12.5,6.62 18.9,6.62 21.64,9.36 37.74,9.36 38.7,8.4 41.46,8.4 arc90 v41.52,8.46
  Bottom 0.406: 11.61,9.21 C28.2 12.93,9.18 v13.11,9.36 | C32.1 17.18,61.59 v16,60.41
05Z_3.3V
  Top 0.254: S1.2 S1.1
  Bottom 0.152: M1.3.3V 99.06,41.52 96.62,43.95 96.62,59.5 91.44,64.68 53.19,64.68 52.12,65.75 41.3,65.75 39.01,63.46 39.01,59.83 S1.1
A_I  (via drill 0.38)
  Top 0.152: IC1.25 41.57,42.7 42.06,43.19 42.06,45.53 SJ4.2 43.64,46.44 v45.57,48.37 | M1.A2_PTA8 87.99,61.84 M2.P$20
  Bottom 0.152: v45.57,48.37 46.79,48.37 48.62,50.2 61.57,50.2 62.94,51.57 80.92,51.57 86.26,56.91 87.17,56.91 87.94,57.67 87.94,59.24 M2.P$20
ADC_REF  (via drill 0.38)
  Top 0.152: M1.AVDD 52.48,29.83 59.74,37.1 v59.74,37.55 | IC1.24 40.01,42.2 v39.62,42.58 | v49.23,42.43 49.23,42.28 50.29,41.21 59.13,41.21 v60.5,39.84
  Bottom 0.152: v39.62,42.58 39.47,42.58 39.01,43.04 39.01,45.33 39.93,46.24 41.3,46.24 41.76,45.78 41.76,45.33 43.43,43.65 48.01,43.65 v49.23,42.43 | v60.5,39.84 60.5,38.31 v59.74,37.55 | M2.VOUT 63.8,12.76 62.64,13.93 62.64,18.1 M1.AVDD
AVDD  (via drill 0.38)
  Top 0.152: v39.62,43.65 40.73,43.65 IC1.27
  Bottom 0.152: v39.62,43.65 41.02,43.65 C6.2
B_I  (via drill 0.38)
  Top 0.152: IC1.26 41.46,43.2 41.76,43.5 41.76,47.31 42.06,47.61 42.62,47.61 SJ4.1 43.33,47.97 v44.96,49.59 | M2.P$19 97.84,57.97 M1.A1_PTB9
  Bottom 0.152: v44.96,49.59 47.55,49.59 48.46,50.51 61.27,50.51 62.64,51.88 80.57,51.88 M2.P$19
BAT+
  pour Bottom: 5.64,64.22 26.97,64.22 26.97,72.15 5.64,72.15
BST_A  (via drill 0.38)
  Top 0.152: IC1.48 33.33,34.66 34.44,34.66 v34.59,34.51
  Bottom 0.152: C9.1 31.88,34.94 32.16,34.66 34.44,34.66 v34.59,34.51
BST_B  (via drill 0.38)
  Top 0.152: v34.59,37.25 33.33,37.25 IC1.43
  Bottom 0.152: C8.1 34.57,37.22 v34.59,37.25
BST_BK  (via drill 0.38)
  Top 0.152: 33.31,32.68 IC1.52 33.81,32.7 34.14,32.37 34.14,32.22 v34.59,31.76
  Bottom 0.152: v34.59,31.76 35.33,31.76 C11.1
BST_C  (via drill 0.38)
  Top 0.152: IC1.38 33.3,39.69 34.29,39.69 v34.59,39.99
  Bottom 0.152: C10.1 34.42,39.81 v34.59,39.99
C_I  (via drill 0.38)
  Top 0.152: M1.A0_PTB8 87.99,56.76 M2.P$18 88.09,54.01 88.09,19.72 87.17,18.81 v46.03,18.81 | IC2.1 20.91,16.3 v21.05,16.16
  Bottom 0.152: v46.03,18.81 45.73,19.11 32.46,19.11 28.5,15.15 23.75,15.15 R22.2 21.52,15.68 v21.05,16.16
CP1  (via drill 0.38)
  Top 0.152: v39.47,36.79 39.93,37.25 40.74,37.25 IC1.14
  Bottom 0.152: C4.2 40.41,37.73 v39.47,36.79
CP2  (via drill 0.38)
  Top 0.152: v39.47,37.7 IC1.15
  Bottom 0.152: C4.1 40.46,38.7 v39.47,37.7
CS_DRV  (via drill 0.38)
  Top 0.152: M2.P$8 84.78,30.03 77.57,37.25 v67.82,37.25 | v39.62,34.66 39.62,34.51 39.93,34.2 IC1.8
  Bottom 0.152: v67.82,37.25 66.6,36.03 64.47,36.03 64.31,36.18 63.09,36.18 62.79,36.49 52.27,36.49 51.82,36.03 47.24,36.03 45.41,34.2 40.08,34.2 v39.62,34.66
CS_EXT  (via drill 0.38)
  Top 0.152: JP4.5 54.05,7.69 54.37,8.01 v55.59,8.01
  Bottom 0.152: M1.PTA10_D4 83.77,59.3 86.41,61.94 87.33,61.94 88.7,60.56 88.7,49.85 M2.P$15 89.76,44.72 89.76,15.46 87.78,13.47 85.04,13.47 79.57,8.01 v55.59,8.01
DC_CAL  (via drill 0.38)
  Top 0.152: v41.91,35.72 41.45,36.18 40.8,36.18 IC1.12
  Bottom 0.152: R7.2 43.71,35.9 43.59,36.03 42.22,36.03 v41.91,35.72
DRV_CLK  (via drill 0.38)
  Top 0.152: IC1.11 39.75,35.7 v39.62,35.57 | v66.14,36.64 77.52,36.64 M2.P$7
  Bottom 0.152: v39.62,35.57 40.23,35.57 40.84,34.96 43.28,34.96 43.59,34.66 44.96,34.66 46.63,36.33 51.51,36.33 51.97,36.79 62.94,36.79 63.09,36.64 v66.14,36.64
DRV_MISO  (via drill 0.38)
  Top 0.152: JP4.4 53.61,6.99 53.61,7.7 49.19,12.12 SJ2.2 46.9,13.51 v45.72,14.69 45.72,14.54 | IC1.10 41.52,35.2 42.06,34.66 47.4,34.66 v47.55,34.51 | M2.P$6 65.89,24.95 64.77,23.84 54.25,23.84 51.97,26.12 50.29,26.12 49.99,26.43 49.07,26.43 48.16,25.51 v48.16,25.06
  Bottom 0.152: 45.87,14.85 v45.72,14.69 47.85,16.83 47.85,24.75 v48.16,25.06 47.85,25.36 47.85,32.83 47.55,33.13 v47.55,34.51
DRV_MOSI  (via drill 0.38)
  Top 0.152: JP4.2 52.54,7.55 50.49,9.6 47.48,9.6 arc90 SJ6.2 46.95,10.52 v46.93,10.54 | IC1.9 41.56,34.7 41.91,34.35 42.22,34.35 42.37,34.2 46.33,34.2 47.09,33.44 v48.16,33.44 | M2.P$5 65.43,22.41 64.31,23.53 54.1,23.53 51.82,25.82 v49.53,25.82
  Bottom 0.152: v48.16,33.44 48.16,30.39 48.92,29.63 48.92,28.71 49.53,28.1 v49.53,25.82 48.92,25.21 48.92,24.9 48.16,24.14 48.16,11.77 v46.93,10.54
DTC  (via drill 0.38)
  Top 0.152: v39.62,33.59 39.78,33.74 40.74,33.74 IC1.7
  Bottom 0.152: R6.2 39.55,33.67 v39.62,33.59
DVDD  (via drill 0.38)
  Top 0.152: v39.62,41.67 40.75,41.67 IC1.23
  Bottom 0.152: C5.2 39.65,41.64 v39.62,41.67
EN_GATE  (via drill 0.38)
  Top 0.152: IC1.16 43.4,38.2 v43.74,37.86 | v39.01,48.98 39.01,49.13 S2.2
  Bottom 0.152: v43.74,37.86 43.74,38.62 42.82,39.53 39.62,39.53 38.71,40.45 38.71,48.68 v39.01,48.98
ENABLE  (via drill 0.38)
  Top 0.152: v40.08,51.42 S2.3
  Bottom 0.152: M2.P$27 61.47,47.61 M1.PTB10_D8 45.11,47.61 41.45,51.27 40.23,51.27 v40.08,51.42
ENC_CLK  (via drill 0.38)
  Top 0.152: v25.14,14.53 29.1,14.53 33.22,18.66 43.43,18.66 46.33,21.55 46.33,25.82 49.53,29.02 49.53,33.54 M1.SCK_PTB0_D13 | v14.52,7.83 14.46,7.83 14,8.3 14,9.8 14.43,10.23 IC3.9
  Bottom 0.152: v14.52,7.83 18.44,7.83 v25.14,14.53 | M1.SCK_PTB0_D13 62.23,34.91 63.09,34.05 83.21,34.05 85.5,36.33 87.78,36.33 88.54,37.1 88.54,40.85 M2.P$13
ENC_CS  (via drill 0.38)
  Top 0.152: M1.A5_PTB13 91.34,69.45 83.67,61.78 83.67,48.27 M2.P$14 | v40.65,9.68 40.65,8.31 41.26,7.7 41.26,6.95 JP5.5 | IC3.4 16.62,13.48 17,13.1 17,7.14 18.59,5.55 24.08,5.55 25.3,6.77 30.53,6.77 32.1,5.2 35.4,5.2 36.6,6.4 36.6,7.8 v38.5,9.7
  Bottom 0.152: M2.P$14 89,42.94 89,15.46 87.33,13.78 84.89,13.78 80.61,9.5 53,9.5 47.9,4.4 45.2,4.4 42.8,6.8 42.8,8.8 41.92,9.68 v40.65,9.68 40.63,9.7 v38.5,9.7
ENC_DIO
  Top 0.152: IC3.10 15.46,7.61 18.13,4.94 24.08,4.94 25.45,6.31 30.39,6.31 31.9,4.8 35.8,4.8 37.1,6.1 37.1,7.3 40.1,10.3 40.1,11.54 SJ1.2
ENC_MISO  (via drill 0.38)
  Top 0.152: 43.28,10.02 42.48,9.23 42.48,6.33 42.02,5.87 40.96,5.87 40.8,6.03 40.8,6.99 JP5.4 | 43.28,10.02 SJ2.1 44.5,13 v44.5,15.76 | v46.94,28.56 46.94,28.87 48.01,29.93 48.01,30.85 49.07,31.91 49.07,35.62 M1.MISO_PTA6_D12 | SJ1.1 43.28,10.06 43.28,10.02
  Bottom 0.152: v46.94,28.56 47.24,28.26 47.24,17.13 46.02,15.91 45.41,15.91 45.26,15.76 v44.5,15.76 | M1.MISO_PTA6_D12 56.59,37.45 59.74,40.6 61.27,40.6 62.94,38.92 83.52,38.92 85.8,36.64 87.48,36.64 88.24,37.4 88.24,38.62 M2.P$12
ENC_MOSI  (via drill 0.38)
  Top 0.152: 39.74,6.03 39.74,6.92 JP5.2 39.75,5.86 40.5,5.11 42.33,5.11 42.94,5.72 42.94,8.46 43.55,9.07 SJ6.1 v45.43,10.61 | v47.24,30.85 48.77,32.37 48.77,37.86 M1.MOSI_PTA_D11 | SJ1.3 38.66,12.66 v39,13
  Bottom 0.152: v47.24,30.85 47.55,30.54 47.55,16.98 46.18,15.61 45.57,15.61 44.96,15 44.96,12.9 | M1.MOSI_PTA_D11 58.37,39.99 59.59,41.21 83.11,41.21 M2.P$11 | 44.96,12.9 44.96,11.08 v45.43,10.61 | v39,13 44.86,13 44.96,12.9
FAULT  (via drill 0.38)
  Top 0.152: v39.17,29.63 37.03,29.63 v34.44,27.04 34.44,26.43 34.9,25.97 35.31,25.97 Q2.1 | v41.91,33.59 41.45,33.13 40.85,33.13 IC1.6
  Bottom 0.152: v34.44,27.04 36.04,27.04 R9.1 | v41.91,33.59 40.08,31.76 40.08,30.54 v39.17,29.63
GH_A  (via drill 0.38)
  Top 0.152: Q4.4 16.75,43.81 v16.76,43.8 | v29.57,34.66 29.72,34.66 30.18,35.11 33.2,35.11 IC1.47
  Bottom 0.152: v16.76,43.8 22.71,43.8 23.62,42.89 24.38,42.89 24.69,43.19 27.13,43.19 27.58,42.73 27.58,35.27 28.19,34.66 v29.57,34.66
GH_B  (via drill 0.38)
  Top 0.152: IC1.42 32.3,37.7 31.24,36.64 28.8,36.64 28.35,37.1 25.15,37.1 v23.93,35.88 | v16.61,33.9 15.69,33.9 Q5.4
  Bottom 0.152: v23.93,35.88 23.47,35.42 18.14,35.42 v16.61,33.9
GH_C  (via drill 0.38)
  Top 0.152: Q6.4 16.37,24.05 v16.46,24.14 | v26.98,40.75 31.39,40.75 31.85,40.3 33.19,40.3 IC1.37
  Bottom 0.152: v16.46,24.14 25.6,24.14 26.36,24.9 26.36,40.14 v26.98,40.75
GL_A  (via drill 0.38)
  Top 0.152: Q7.4 18.79,50.4 v18.9,50.51 | v28.8,35.72 31.85,35.72 32.31,36.18 33.26,36.18 IC1.45
  Bottom 0.152: v28.8,35.72 28.19,36.33 28.19,43.65 27.58,44.26 19.2,44.26 18.9,44.56 v18.9,50.51
GL_B  (via drill 0.38)
  Top 0.152: Q8.4 19.09,39.58 19.66,40.14 30.94,40.14 v31.09,39.99 | v34.59,39.08 34.29,38.77 33.35,38.77 IC1.40
  Bottom 0.152: v34.59,39.08 35.2,39.69 35.2,40.3 34.9,40.6 34.29,40.6 34.14,40.45 33.83,40.45 33.68,40.3 31.39,40.3 v31.09,39.99
GL_C  (via drill 0.38)
  Top 0.152: Q9.4 19.09,29.82 v19.81,30.54 | v26.82,42.58 30.79,42.58 32.16,41.21 IC1.35
  Bottom 0.152: v19.81,30.54 24.84,30.54 25.76,31.46 25.76,41.67 26.67,42.58 v26.82,42.58
GND  (via drill 0.38)
  Top 0.152: v38.52,6.48 38.97,6.94 JP5.1 39.28,6.97 39.28,7.55 39.59,7.85 40.04,7.85 40.25,7.65 JP5.3 | 46.6,6.88 JP7.3 | 47.66,6.92 JP7.5 47.66,6.95 47.66,7.55 47.36,7.85 46.75,7.85 46.65,7.76 JP7.3 | JP6.3 33.69,6.88 33.69,6.33 33.38,6.03 33.08,6.03 32.74,6.36 JP6.1 32.32,6.94 v32.01,6.94 | JP4.3 53.05,6.23 52.84,6.03 52.39,6.03 52.08,6.33 52.08,6.91 JP4.1 v51.32,6.94 | JP7.3 46.6,6.99 46.6,7.7 46.44,7.85 45.99,7.85 45.65,7.52 JP7.1 v44.92,6.94 | IC1.28 40.78,45.42 v41,45.63 | IC2.4 23.77,19.46 v24.52,18.71
  Top 0.254: v50.5,8.5 51.32,7.68 v51.32,6.94
  Top 0.406: IC3.5 13.8,12.83 13.73,12.9 v13.7,12.9 | v11.5,11.6 12.73,12.83 13.63,12.83 v13.7,12.9 | IC3.2 14.28,14.78 13.7,14.2 v13.7,12.9
  Bottom 0.152: R20.1 14.68,18.02 C13.1 14.91,19.62 C26.2 14.86,19.95 | C27.2 17.96,20.05 18.9,19.11 19.53,19.11 19.51,19.09 R24.2 19.53,18.96 20.27,18.96 | v41,45.63 41,44.64 C6.1 | C3.2 43.31,35.55 43.89,34.96 44.81,34.96 45.41,35.57 45.41,36.33 45.26,36.49 44.93,36.49 R7.1 | R15.1 v41.15,23.99 | R4.2 39.04,31.58 37.95,32.68 37.95,34.51 38.1,34.66 38.58,34.66 R6.1
  Bottom 0.254: v19.36,69.71 19.56,69.51 R29.1 18.14,68.92 C29.2 18.09,70.33 R13.1 | v23.77,57.97 23.77,56.63 R27.2 21.84,56.12 C37.2 R39.1 | C20.2 16.15,53.58 | 16.15,53.58 15.88,53.58 v15.09,52.79 | 16,55.54 16,53.73 16.15,53.58 | C30.2 10.53,57.39 C19.2 12.47,57.06 13.11,57.06 15.09,55.08 15.54,55.08 16,55.54 | R20.1 12.83,16.95 12.8,16.98 | ICN.1 ICN.2 16,55.91 16,55.54
  Bottom 0.406: 23.71,58.04 v23.77,57.97 | C17.2 16.1,51.78 v15.09,52.79 | v19.66,62.7 20.59,62.7 C32.2
  other vias: 30.94,37.4
  pour Bottom: 27.89,71.69 103.17,71.84 103.17,3.42 1.07,3.42 1.07,72 4.72,72 4.72,21.09 27.89,21.09 27.74,34.5 27.74,57.06 18.44,57.06 18.44,63.31 27.89,63.31
  pour Top: 42.21,23.53 24.99,23.53 24.99,51.57 1.07,51.57 1.07,72 42.21,72.15
GVDD  (via drill 0.38)
  Top 0.152: v41.91,36.64 40.85,36.64 IC1.13
  Bottom 0.152: C3.1 42.04,36.51 v41.91,36.64
I_BATT  (via drill 0.38)
  Top 0.406: v13.41,58.89 9.75,58.89 v9.14,59.5
  Bottom 0.254: R26.2 14.77,65.37 Q3.3
  Bottom 0.406: 15.24,58.89 v13.41,58.89 | v9.14,59.5 8.52,59.5 R30.1
  pour Bottom: 5.64,57.21 17.68,57.21 17.68,63.31 5.64,63.31
N$1  (via drill 0.38)
  Top 0.152: v42.22,31.15 40.83,31.15 IC1.2
  Bottom 0.152: C1.1 43.2,29.63 R2.2 42.32,31.25 v42.22,31.15
N$2
  Bottom 0.152: R2.1 C2.1
N$3  (via drill 0.38)
  Top 0.254: v38.1,20.79 37.05,20.79 LED1.C
  Bottom 0.254: R10.2 38.01,20.7 v38.1,20.79
N$4  (via drill 0.38)
  Top 0.254: LED2.C 35.29,20.7 v35.36,20.64
  Bottom 0.254: v35.36,20.64 34.4,20.64 R11.2
N$5  (via drill 0.38)
  Top 0.152: Q1.2 38.67,23.95 38.1,23.38 v38.1,22.16
  Bottom 0.152: v38.1,22.16 36.97,22.16 R10.1
N$6  (via drill 0.38)
  Top 0.152: Q2.2 33.95,23.95 v32.77,22.77
  Bottom 0.152: v32.77,22.77 33.77,22.77 R11.1
N$7
  Bottom 0.254: C20.1 18.64,52.62 R12.1
N$8  (via drill 0.38)
  Top 0.254: v40.54,20.79 39.31,20.79 LED3.C
  Bottom 0.254: R15.2 40.45,20.7 v40.54,20.79
N$9
  Bottom 0.61: Q3.1 11.82,72 16.62,72 R13.2
N$10  (via drill 0.38)
  Top 0.152: LED4.C 31.76,20.09 v32.77,21.09
  Bottom 0.152: R14.2 31.76,20.09 v32.77,21.09
N$11
  Top 0.406: SJ7.3 27.38,69.4 JP2.2
N$12  (via drill 0.38)
  Top 0.152: IC2.8 18.31,15.6 v17.86,15.15
  Bottom 0.152: R20.2 14.78,15.89 R19.1 16.1,15.5 16.5,15.1 17.81,15.1 v17.86,15.15
N$13
  Top 0.406: JP3.2 31.75,65.29 29.11,65.29 27.13,67.27 24.08,67.27 23.32,66.51 23.32,66.1 SJ8.3
N$14  (via drill 0.38)
  Top 0.152: v17.22,16.22 17.5,16.5 17.5,18.1 17.56,18.16 IC2.7 IC2.6
  Bottom 0.152: C27.1 18.16,19.09 18.75,18.5 | 18.75,18.5 21.06,18.5 21.24,18.68 R21.1 | v17.22,16.22 17.22,16.98 18.75,18.5
N$15  (via drill 0.38)
  Top 0.152: IC2.3 22.27,18.81 v22.3,18.84
  Bottom 0.152: R24.1 21.24,20.05 R21.2 22.05,19.85 22.3,19.6 v22.3,18.84
N$16  (via drill 0.38)
  Top 0.152: IC2.2 21.54,18.16 22.2,17.5 22.2,17.07 v22.25,17.02
  Bottom 0.152: R23.2 R22.1 22.38,16.65 22.38,16.89 v22.25,17.02
N$17
  Top 0.152: IC3.1 6.95,15.43 PAD9.1
N$18
  Bottom 0.254: R38.2 18.44,56.12 ICN.6
N$19
  Top 0.254: LED5.C R25.2
OCTW  (via drill 0.38)
  Top 0.152: IC1.5 41.63,32.7 41.91,32.98 42.67,32.98 v42.82,33.13 | v39.01,26.89 39.01,26.68 Q1.1
  Bottom 0.152: R8.1 38.02,26.89 v39.01,26.89 40.08,27.95 40.08,30.09 40.54,30.54 41,30.54 41.45,31 41.45,32.52 41.91,32.98 42.67,32.98 v42.82,33.13
PH  (via drill 0.38)
  Top 0.152: 33.22,33.13 IC1.51 IC1.50 33.17,33.59 v32.16,33.59
  Bottom 0.152: C11.2 35.43,32.83 35.43,33.67 35.2,33.9 34.29,33.9 34.14,34.05 32.61,34.05 v32.16,33.59 | 35.59,32.98 C11.2 | C11.2 35.8,33.01 L1.1
  Bottom 0.254: D1.C 37.34,37.18 37.34,34.54 L1.1
PWM_AH
  Top 0.152: IC1.17 46.26,38.7 48.46,40.91 48.46,46.85 50.29,48.68 53.95,48.68 55.17,49.9 55.17,57.57 M1.PTB5_D3 52.22,60.51
  Bottom 0.152: M2.P$21 52.22,60.51 M1.PTB5_D3
PWM_AL
  Top 0.152: IC1.18 46.3,39.2 48.16,41.06 48.16,47 50.14,48.98 53.8,48.98 54.86,50.05 54.86,52.79 M1.PTA12_D5
  Bottom 0.152: M2.P$22 52.12,57.97 M1.PTA12_D5
PWM_BH
  Top 0.152: IC1.19 46.34,39.7 47.85,41.21 47.85,47.15 49.99,49.29 53.65,49.29 54.56,50.2 54.56,50.56 M1.PTB6_D6
  Bottom 0.152: M2.P$23 52.12,55.43 M1.PTB6_D6
PWM_BL
  Top 0.152: IC1.20 46.39,40.2 47.55,41.36 47.55,47.31 49.84,49.59 49.84,50.61 M1.PTB7_D7
  Bottom 0.152: M2.P$24 52.12,52.89 M1.PTB7_D7
PWM_CH  (via drill 0.38)
  Top 0.152: IC1.21 44.91,40.7 v45.11,40.91
  Bottom 0.152: M2.P$25 63.8,49.34 65.23,47.92 65.23,44.56 64.62,43.95 52.02,43.95 M1.PTB11_D9 51.97,44 51.97,41.82 51.51,41.36 46.02,41.36 45.57,40.91 v45.11,40.91
PWM_CL  (via drill 0.38)
  Top 0.152: IC1.22 43.58,41.2 v44.04,41.67
  Bottom 0.152: v44.04,41.67 50.04,41.67 M1.PTA_D10 49.68,43.75 49.68,45.48 50.44,46.24 51.82,46.24 53.8,44.26 64.31,44.26 64.92,44.87 64.92,45.63 63.8,46.75 M2.P$26
PWR_ENABLE1
  Bottom 0.254: R27.1 25.3,55.16 R28.2 25.17,55.21 24.69,55.69 24.69,57.82 25.6,58.74 25.6,59.41 IC5.5 IC5.4
PWRGD  (via drill 0.38)
  Top 0.152: v42.22,32.22 40.8,32.22 IC1.4
  Bottom 0.152: R5.2 42.49,32.5 v42.22,32.22
RST_05Z
  Top 0.254: S1.4 S1.3
  Bottom 0.152: M1.RESET 99.16,39.59 96.01,42.73 96.01,59.5 91.29,64.22 53.03,64.22 51.82,65.44 43.36,65.44 S1.3
RT_CLK  (via drill 0.38)
  Top 0.152: v40.69,29.78 40.69,30.61 IC1.1
  Bottom 0.152: R1.2 40.79,29.68 v40.69,29.78
SCL  (via drill 0.38)
  Top 0.152: JP7.4 47.15,6.15 47.4,5.9 48.5,5.9 49.21,6.61 v49.21,8.12
  Bottom 0.152: M2.P$10 86.67,34.1 87.94,32.83 87.94,32.07 87.17,31.3 67.06,31.3 64.62,28.87 53.65,28.87 51.51,31 50.44,31 49.84,30.39 49.84,29.02 50.44,28.41 51.51,28.41 52.43,27.49 52.43,26.27 M1.I2C_SCL_PTB3_D15 49.99,24.75 48.77,23.53 48.77,8.56 v49.21,8.12
SDA  (via drill 0.38)
  Top 0.152: JP7.2 46.15,5.73 45.13,5.73 v43.84,7.02
  Bottom 0.152: M1.12C_SDA_PTB4_D14 50.9,26.27 48.46,23.84 48.46,8.04 44.86,8.04 v43.84,7.02 | M2.P$9 65.89,32.57 64.62,31.3 50.29,31.3 49.53,30.54 49.53,28.66 M1.12C_SDA_PTB4_D14 | 50.95,27.34 M1.12C_SDA_PTB4_D14
SENSE_I_BATT  (via drill 0.38)
  Top 0.152: v22.55,54.01 28.8,54.01 v28.96,54.16 | M2.P$16 86.67,51.22 87.78,52.34 87.78,53.4 87.02,54.16 86.41,54.16 85.19,55.38 85.19,55.84 85.95,56.6 | 85.95,56.6 86.11,56.76 87.48,56.76 87.94,57.21 97.84,57.21 98.6,57.97 99.67,57.97 100.43,58.74 100.43,63.1 M1.A3_PTA0 | v84.89,57.52 85.04,57.52 85.95,56.6
  Bottom 0.152: C37.1 21.74,54.83 v22.55,54.01 | v28.96,54.16 49.38,54.16 50.44,53.1 51.66,53.1 52.58,54.01 81.38,54.01 v84.89,57.52
  Bottom 0.254: 20.12,55 R39.2 | R39.2 C37.1 | R38.1 20.07,55.16 R39.2
SENSE_V_BATT
  Top 0.152: M1.A4_PTA9 90.02,66.92 84.28,61.17 84.28,55.28 M2.P$17
  Bottom 0.152: R26.1 22.07,66.33 28.04,72.3 93.78,72.3 M1.A4_PTA9
  Bottom 0.254: C29.1 19.56,68.01 R29.2 R26.1
SH_A  (via drill 0.38)
  Top 0.152: IC1.46 33.31,35.72 34.29,35.72 v34.59,35.42 | Q7.8 23.7,43.72 v23.77,43.65
  Bottom 0.152: C9.2 32.13,35.9 32.61,35.42 v34.59,35.42 | v23.77,43.65 27.58,43.65 27.89,43.34 27.89,35.42 28.35,34.96 28.96,34.96 30.02,36.03 31.37,36.03 C9.2 | 31.47,35.88 C9.2
  pour Top: 5.64,41.06 24.38,41.06 24.38,51.12 5.64,51.12
SH_B  (via drill 0.38)
  Top 0.152: v34.59,38.16 33.32,38.16 IC1.41 33.24,38.16 28.65,38.16 28.19,37.7 22.86,37.7 21.95,36.79 21.9,36.79 21.7,36.58 | Q8.8 22.92,35.63 22.65,35.63 21.7,36.58 | 21.7,36.58 Q8.PAD
  Bottom 0.152: C8.2 34.57,38.19 v34.59,38.16
  pour Top: 24.38,40.45 5.64,40.45 5.64,30.69 24.38,30.69
SH_C  (via drill 0.38)
  Top 0.152: 33.34,40.75 IC1.36 33.21,40.78 | 33.21,40.78 31.98,40.78 31.09,41.67 v26.67,41.67 | v24.69,26.73 21.4,26.73 Q9.PAD | 33.21,40.78 34.01,40.78 v34.44,41.21
  Bottom 0.152: v26.67,41.67 26.06,41.06 26.06,28.1 v24.69,26.73 | C10.2 34.01,40.78 v34.44,41.21
  pour Top: 5.64,30.24 24.38,30.24 24.38,21.55 5.64,21.55
SL_A  (via drill 0.38)
  Top 0.152: C25.1 27.16,48.11 25.15,46.09 25.15,43.65 | 25.15,43.65 25.3,43.5 31.09,43.5 32.31,42.28 33.21,42.28 IC1.33 33.36,42.12 v34.59,42.12 | 25.15,43.65 23.16,41.67 SJ3.2 | SJ5.2 31.39,27.8 31.39,29.02 30.18,30.24 28.65,30.24 28.19,30.7 27.43,30.7 24.99,33.13 24.99,35.88 25.45,36.33 31.7,36.33 32,36.64 33.22,36.64 IC1.44 34.23,36.7 v34.59,36.33
  Top 0.254: C25.1 28.07,48.11 R16.2
  Top 1.27: Q7.3 Q7.2 Q7.1 26.84,49.27 R16.2
  Bottom 0.152: v34.59,36.33 34.9,36.33 35.2,36.64 35.2,38.47 35.51,38.77 35.51,39.23 35.81,39.53 35.81,40.14 35.36,40.6 35.36,41.36 v34.59,42.12
SL_B  (via drill 0.38)
  Top 0.152: IC1.39 31.24,39.2 30.79,38.74 v30.79,38.77 30.36,39.2 29.65,39.2 C23.1 | SJ3.1 20.42,41.67 18.29,39.53 18.29,38.47 18.44,38.31 19.75,38.31 Q8.3 | IC1.31 32.3,43.2 v32.16,43.34
  Top 0.254: C23.1 26.74,38.96 R17.2
  Top 1.27: Q8.3 Q8.2 Q8.1 26.7,38.96 R17.2
  Bottom 0.152: v32.16,43.34 32.16,42.28 30.33,40.45 30.33,39.23 v30.79,38.77
SL_C  (via drill 0.38)
  Top 0.152: Q9.1 22.92,29.69 v24.69,31.46 | v25.45,42.28 26.36,43.19 30.79,43.19 32.31,41.67 33.25,41.67 IC1.34 | SJ5.1 29.21,28.46 C24.1 29.16,29.44 29.03,29.44 | Q9.1 25.45,26.89 25.45,26.58 24.54,25.67 24.54,20.79 v23.93,20.18
  Top 0.254: R18.2 29.03,29.44
  Top 1.27: Q9.3 Q9.2 Q9.1 26.59,29.41 R18.2
  Bottom 0.152: v24.69,31.46 25.45,32.22 v25.45,42.28 | v23.93,20.18 23.93,19.9 R23.1
SS_TR  (via drill 0.38)
  Top 0.152: v34.44,30.54 34.29,30.7 IC1.56
  Bottom 0.152: v34.44,30.54 34.44,29.65 C7.1
U
  Top 0.152: M1.TX_PTB2_D0 58.17,69.45 67.06,60.56 67.06,40.91 M2.P$30 63.75,37.7 62.03,37.7 52.73,28.41 50.39,28.41 47.24,25.26 47.24,20.94 44.04,17.74 39.78,17.74 38.05,16.01 JP8.2 35.84,13.7 29.9,13.7 26.1,9.9 | IC3.11 24.08,9.58 24.4,9.9 26.1,9.9 | JP6.5 34.74,9.36 34.2,9.9 26.1,9.9
V
  Top 0.152: M1.RX_PTB1_D1 60.25,66.92 66.6,60.56 66.6,42.99 M2.P$29 | M2.P$29 63.6,40.19 | M2.P$29 63.75,40.14 63.25,40.14 51.82,28.71 50.14,28.71 46.94,25.51 46.94,21.09 43.89,18.05 37.64,18.05 JP8.3 33.7,14.1 29.7,14.1 25.83,10.23 IC3.12 22.23,10.23 21.8,9.8 21.8,9.3 22.2,8.9 24,8.9 24.5,9.4 32.8,9.4 34.24,7.96 JP6.4
V3IN1  (via drill 0.38)
  Top 0.406: SJ8.2 24.64,61.12 v22.25,58.74
  Bottom 0.406: v22.25,58.74 22.25,59.01 IC5.6
V5IN1  (via drill 0.38)
  Top 0.406: 23.47,69.86 23.47,69.56 | 23.47,69.56 SJ7.2 | 23.47,69.56 23.47,67.88 23.32,67.73 21.95,67.73 21.34,67.12 21.34,64.83 22.56,63.61 v22.87,63.61
  Bottom 0.406: IC5.10 22.76,63.49 v22.87,63.61
V_BATT  (via drill 0.38)
  Top 0.152: v32.16,31.76 33.22,31.76 IC1.54 IC1.53 | IC1.29 30.23,44.2 v29.87,44.56 | LED4.A 31.08,22.16 30.34,22.16 29.6,22.9 26.8,22.9 v26.06,22.16
  Top 0.254: M1.VIN 99.42,51.67 100.74,50.35 100.74,28.87 M2.VIN 66.04,14.79 64.92,15.91 47.46,15.91 v45.63,17.74
  Top 0.406: v13.87,46.85 Q4.PAD 14.48,47.47 14.48,48.37 | v14.94,47.92 14.94,48.22 14.48,48.68 | 14.48,48.68 14.48,49.35 Q4.6 | Q4.5 15.82,48.8 v14.94,47.92 | 14.48,48.68 14.48,48.37 | 14.48,48.37 v14.94,47.92 | v14.94,47.92 v12.8,47.92 | Q4.8 11.98,48.74 v12.8,47.92 | Q4.7 13.28,48.39 v12.8,47.92 | Q5.5 15.7,39.38 15.7,38.77 15.09,38.16 v14.78,38.16 14.35,38.6 Q5.6 | Q5.7 13.12,38.64 v12.65,38.16 12.34,38.16 12.04,38.47 11.89,38.47 11.89,39.35 Q5.8 | v13.72,37.1 13.72,36.96 Q5.PAD | v13.56,27.19 13.56,27.16 Q6.PAD | v14.63,28.26 14.63,28.41 14.17,28.87 14.17,29.59 Q6.6 14.19,28.7 14.33,28.56 15.24,28.56 15.39,28.71 15.39,29.49 Q6.5 | Q6.8 11.68,29.08 v12.5,28.26 12.97,28.73 Q6.7
  Bottom 0.152: C16.2 31.8,31.41 v32.16,31.76 | C16.2 31.27,30.87 30.63,30.24 27.74,30.24 26.82,29.32 26.82,22.92 v26.06,22.16 | v29.87,44.56 26.06,44.56 25.76,44.87 | C15.2 C16.2
  Bottom 0.254: 16.46,59.65 16.61,59.5 16.15,59.04 ICN.5 16.15,57.37 15.54,56.76 15.54,56.1 ICN.3 | C30.1 11.82,56.11 C19.1 | v45.63,17.74 44.72,18.66 32.61,18.66 28.65,14.69 26.36,14.69 18.75,7.07 13.41,7.07 12.95,7.53 12.95,8.14 13.87,9.05 13.87,10.58 8.13,16.32 8.13,26.07
  Bottom 0.406: IC5.8 19.91,60.51 19.05,59.65 16.46,59.65 12.8,59.65 12.19,59.04 9.91,59.04 8.99,58.13 8.99,56.22 9.11,56.11 | C30.1 9.11,56.11 | 9.11,56.11 7.47,54.47 7.47,54.05 R30.2
  other vias: 14.94,45.78 12.8,45.78 14.78,36.03 12.65,36.03 14.63,26.12 12.5,26.12
  pour Bottom: 5.64,56.45 26.67,56.45 26.82,21.7 5.49,21.7
VSENSE  (via drill 0.38)
  Top 0.152: v39.62,32.52 39.62,32.07 39.93,31.76 40.72,31.76 IC1.3
  Bottom 0.152: R3.2 38.2,31.53 R4.1 39.4,30.62 39.78,31 39.78,32.37 v39.62,32.52
W
  Top 0.152: M1.PTA11_D2 62.18,64.38 66.14,60.41 66.14,45.07 M2.P$28 63.8,41.62 60.66,38.47 59.74,38.47 52.27,31 50.44,31 49.84,30.39 49.84,28.87 46.63,25.67 46.63,21.25 43.74,18.35 33.83,18.35 32.97,17.49 JP8.4 31.01,15.91 25.98,10.88 IC3.13 21.98,10.88 21.4,10.3 21.4,9.1 22.1,8.4 24.1,8.4 24.7,9 31.9,9 33.24,7.66 JP6.2

### Text on the board
tValues: MOTOR_ENABLED | OCTW | 3.3V | FAULT | V_BATT | W V U GND | SPI Drv & Enc Tie-in | G W G V U 3.3 | G E_MOSI G / E_MISO E_CS 5 | G SDA G / SCL G 3.3 | G D_MOSI G / D_MISO EXT_CS 3.3
bValues: Douglas Hutchings / Biomimetic Milisystems Labaratory / 2014.9.28 / Brushless DC Motor Controller / Rev. A